# EAGLE design ABK-ECS - Rev A1 (EAGLE 7.7.0)

## Sheet 1 of 3: MCU
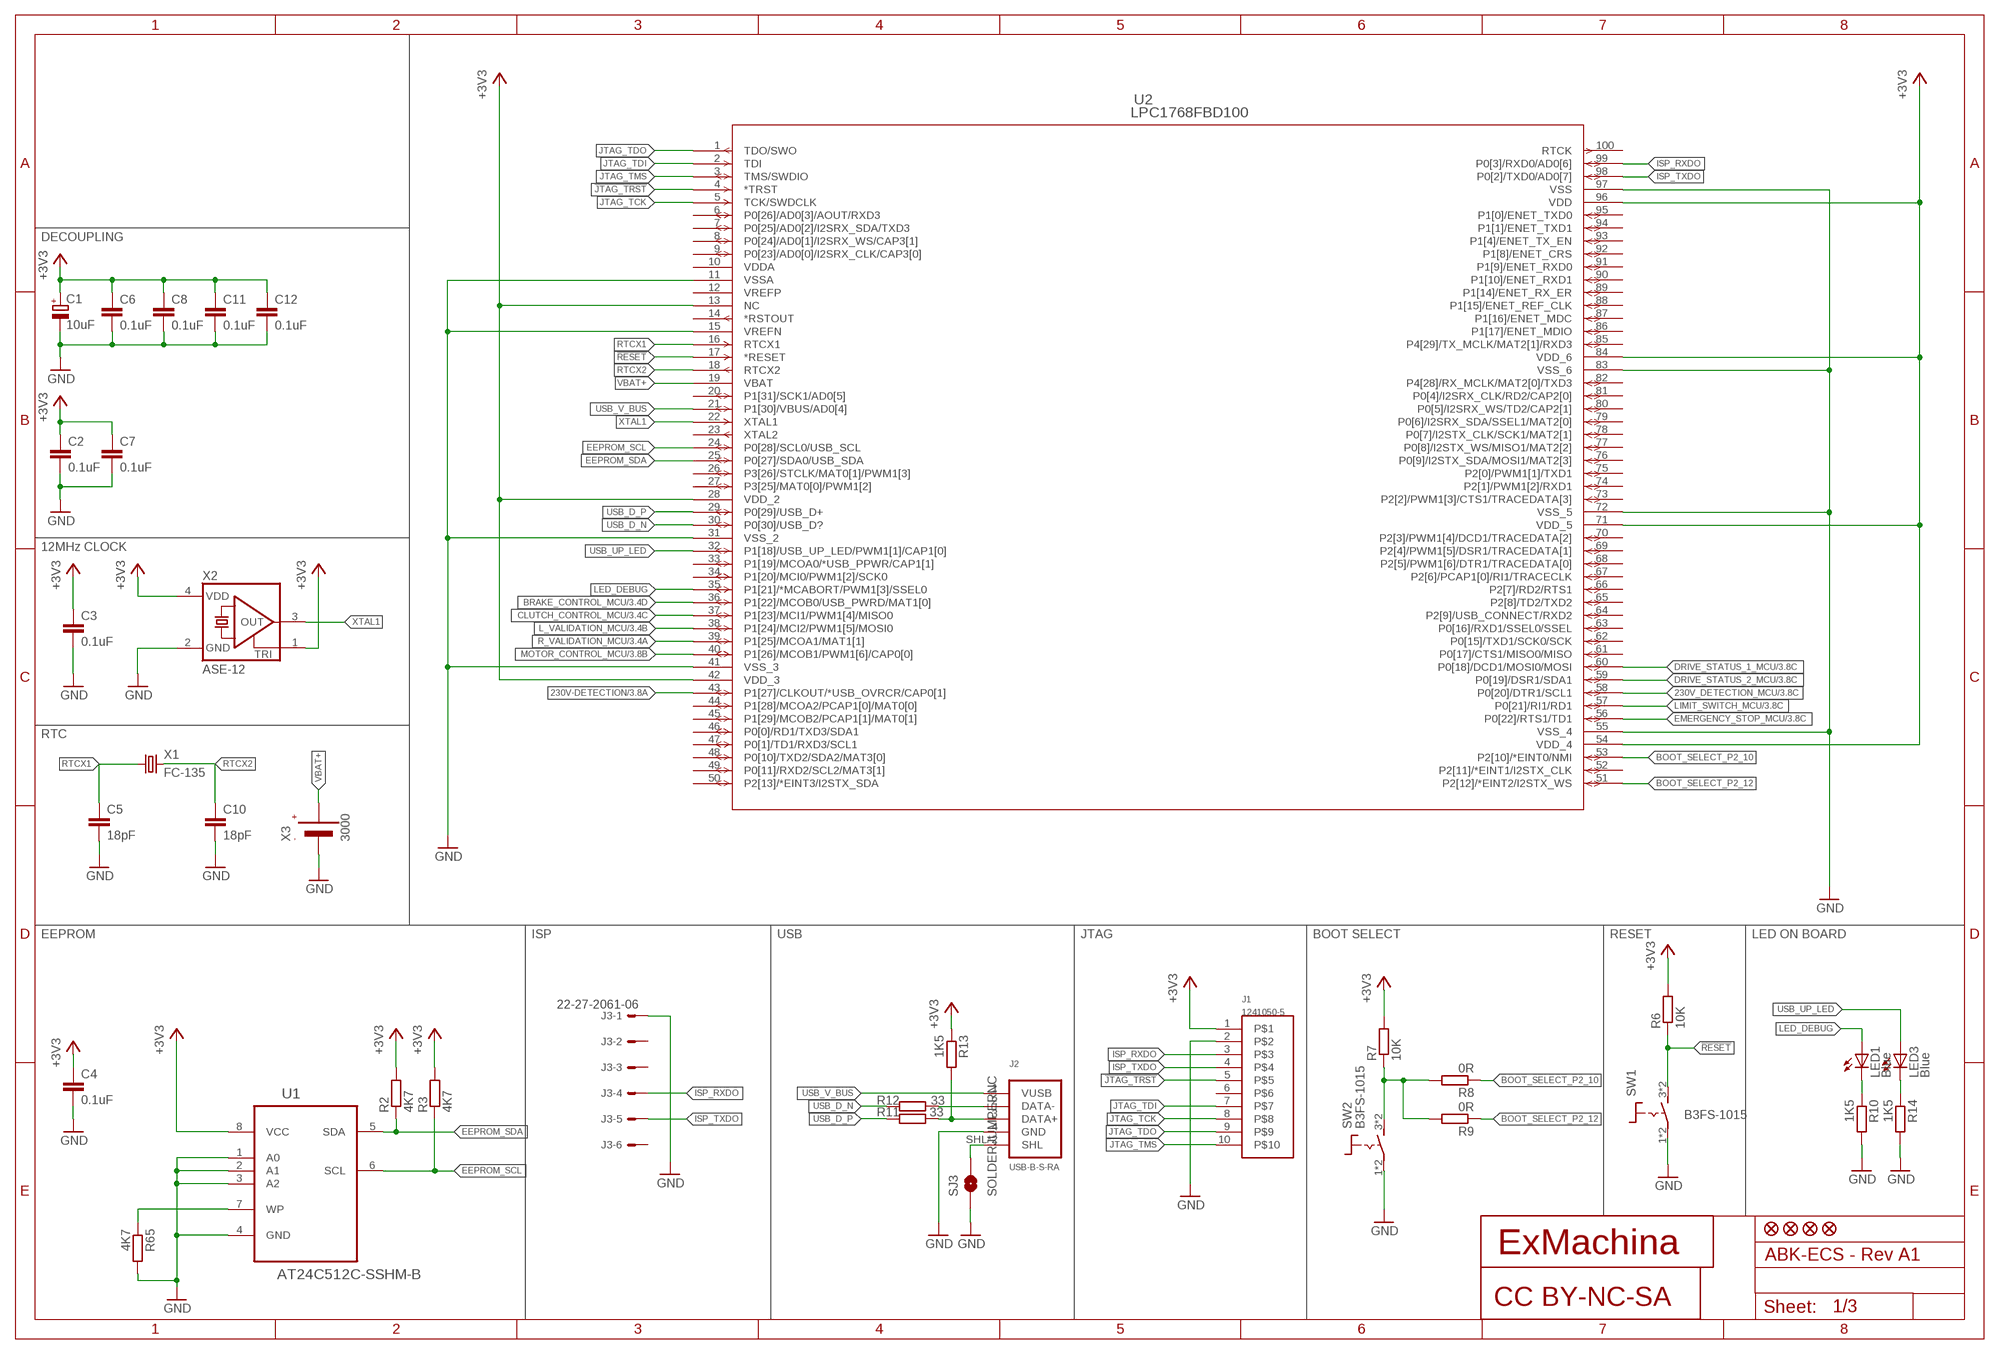
[diagram p0: schematic, sheet 1]

### Parts
C1  10uF  CPOL-EUCT3216  [CT3216]
C2  0.1uF  C-EUC0603  [C0603]
C3  0.1uF  C-EUC0603  [C0603]
C4  0.1uF  C-EUC0603  [C0603]
C5  18pF  C-EUC0603  [C0603]
C6  0.1uF  C-EUC0603  [C0603]
C7  0.1uF  C-EUC0603  [C0603]
C8  0.1uF  C-EUC0603  [C0603]
C10  18pF  C-EUC0603  [C0603]
C11  0.1uF  C-EUC0603  [C0603]
C12  0.1uF  C-EUC0603  [C0603]
CC1  CC-BY-NC-SA  [CC-BY-NC-SA]
J1  1241050-5  [2.54/2X5]
J2  USB-B-S-RA  [USB-B-S-RA]
J3  22-27-2061-06  [6410-06]
JP1  FIDUCIAL1X2  [FIDUCIAL-1X2]
JP2  FIDUCIAL1X2  [FIDUCIAL-1X2]
JP3  FIDUCIAL1X2  [FIDUCIAL-1X2]
JP4  FIDUCIAL1X2  [FIDUCIAL-1X2]
LED1  Blue  LEDCHIPLED_0603  [CHIPLED_0603]
LED3  Blue  LEDCHIPLED_0603  [CHIPLED_0603]
R2  4K7  R-EU_R0603  [R0603]
R3  4K7  R-EU_R0603  [R0603]
R6  10K  R-EU_R0603  [R0603]
R7  10K  R-EU_R0603  [R0603]
R8  0R  R-EU_R0603  [R0603]
R9  0R  R-EU_R0603  [R0603]
R10  1K5  R-EU_R0603  [R0603]
R11  33  R-EU_R0603  [R0603]
R12  33  R-EU_R0603  [R0603]
R13  1K5  R-EU_R0603  [R0603]
R14  1K5  R-EU_R0603  [R0603]
R65  4K7  R-EU_R0603  [R0603]
SJ3  SOLDERJUMPERNC  [SJ_2S]
SW1  B3FS-1015  [B3FS]
SW2  B3FS-1015  [B3FS]
T1  EXMACHINA-LOGO-NAME  [EXM-LOGO-BASELINE]
U1  AT24C512C-SSHM-B  [SOIC127P600X175-8N]
U2  LPC1768FBD100  [SOT407-1]
X1  FC-135  [FC-135]
X2  ASE-12  ASE  [ASE]
X3  3000  [3000]

### Nets
230V-DETECTION: U2.43(P1[27]/CLKOUT/*USB_OVRCR/CAP0[1]) ; also sheet 3
230V_DETECTION_MCU: U2.58(P0[20]/DTR1/SCL1) ; also sheet 3
!JTAG_TRST: J1.5 U2.4(*TRST)
!RESET: R6.1 SW1.3 SW1.4 U2.17(*RESET)
+3V3 [supply]: C1.+ C2.1 C3.1 C4.1 C6.1 C7.1 C8.1 C11.1 C12.1 J1.1 R2.2 R3.2 R6.2 R7.2 R13.1 U1.8(VCC) U2.13(NC) U2.28(VDD_2) U2.42(VDD_3) U2.54(VDD_4) U2.71(VDD_5) U2.84(VDD_6) U2.96(VDD) X2.1(TRI) X2.4(VDD) ; also sheet 2,3
BOOT_SELECT_P2_10 [signal]: R8.1 U2.53(P2[10]/*EINT0/NMI)
BOOT_SELECT_P2_12 [signal]: R9.1 U2.51(P2[12]/*EINT2/I2STX_WS)
BRAKE_CONTROL_MCU: U2.36(P1[22]/MCOB0/USB_PWRD/MAT1[0]) ; also sheet 3
CLUTCH_CONTROL_MCU: U2.37(P1[23]/MCI1/PWM1[4]/MISO0) ; also sheet 3
DRIVE_STATUS_1_MCU: U2.60(P0[18]/DCD1/MOSI0/MOSI) ; also sheet 3
DRIVE_STATUS_2_MCU: U2.59(P0[19]/DSR1/SDA1) ; also sheet 3
EEPROM_SCL: R3.1 U1.6(SCL) U2.24(P0[28]/SCL0/USB_SCL)
EEPROM_SDA: R2.1 U1.5(SDA) U2.25(P0[27]/SDA0/USB_SDA)
EMERGENCY_STOP_MCU: U2.56(P0[22]/RTS1/TD1) ; also sheet 3
GND [supply]: C1.- C2.2 C3.2 C4.2 C5.2 C6.2 C7.2 C8.2 C10.2 C11.2 C12.2 J1.2 J2.4(GND) J3.1 R10.2 R14.2 R65.2 SJ3.1 SW1.1 SW1.2 SW2.1 SW2.2 U1.1(A0) U1.2(A1) U1.3(A2) U1.4(GND) U2.11(VSSA) U2.15(VREFN) U2.31(VSS_2) U2.41(VSS_3) U2.55(VSS_4) U2.72(VSS_5) U2.83(VSS_6) U2.97(VSS) X2.2(GND) X3.-(VBAT-) ; also sheet 2,3
ISP_RXDO [signal]: J1.3 J3.4 U2.99(P0[3]/RXD0/AD0[6])
ISP_TXDO [signal]: J1.4 J3.5 U2.98(P0[2]/TXD0/AD0[7])
JTAG_TCK [signal]: J1.8 U2.5(TCK/SWDCLK)
JTAG_TDI [signal]: J1.7 U2.2(TDI)
JTAG_TDO [signal]: J1.9 U2.1(TDO/SWO)
JTAG_TMS [signal]: J1.10 U2.3(TMS/SWDIO)
L_VALIDATION_MCU: U2.38(P1[24]/MCI2/PWM1[5]/MOSI0) ; also sheet 3
LED_DEBUG [signal]: LED1.A U2.35(P1[21]/*MCABORT/PWM1[3]/SSEL0)
LIMIT_SWITCH_MCU: U2.57(P0[21]/RI1/RD1) ; also sheet 3
MOTOR_CONTROL_MCU: U2.40(P1[26]/MCOB1/PWM1[6]/CAP0[0]) ; also sheet 3
N$1 [signal]: J2.3(DATA+) R11.1 R13.2
N$2 [signal]: J2.2(DATA-) R12.1
N$3 [signal]: LED3.C R14.1
N$5 [signal]: R7.1 R8.2 R9.2 SW2.3 SW2.4
N$27: R65.1 U1.7(WP)
N$29 [signal]: LED1.C R10.1
N$70: J2.SHL J2.SHL1(SHL) SJ3.2
R_VALIDATION_MCU: U2.39(P1[25]/MCOA1/MAT1[1]) ; also sheet 3
RTCX1: C5.1 U2.16(RTCX1) X1.1
RTCX2: C10.1 U2.18(RTCX2) X1.2
USB_D_N [signal]: R12.2 U2.30(P0[30]/USB_D?)
USB_D_P [signal]: R11.2 U2.29(P0[29]/USB_D+)
USB_UP_LED [signal]: LED3.A U2.32(P1[18]/USB_UP_LED/PWM1[1]/CAP1[0])
USB_V_BUS [signal]: J2.1(VUSB) U2.21(P1[30]/VBUS/AD0[4])
VBAT+: U2.19(VBAT) X3.+1(VBAT+) X3.+2(VBAT+)
XTAL1: U2.22(XTAL1) X2.3(OUT)
Unconnected: J1.6 J3.2 J3.3 J3.6 U2.6(P0[26]/AD0[3]/AOUT/RXD3) U2.7(P0[25]/AD0[2]/I2SRX_SDA/TXD3) U2.8(P0[24]/AD0[1]/I2SRX_WS/CAP3[1]) U2.9(P0[23]/AD0[0]/I2SRX_CLK/CAP3[0]) U2.14(*RSTOUT) U2.20(P1[31]/SCK1/AD0[5]) U2.23(XTAL2) U2.26(P3[26]/STCLK/MAT0[1]/PWM1[3]) U2.27(P3[25]/MAT0[0]/PWM1[2]) U2.33(P1[19]/MCOA0/*USB_PPWR/CAP1[1]) U2.34(P1[20]/MCI0/PWM1[2]/SCK0) U2.44(P1[28]/MCOA2/PCAP1[0]/MAT0[0]) U2.45(P1[29]/MCOB2/PCAP1[1]/MAT0[1]) U2.46(P0[0]/RD1/TXD3/SDA1) U2.47(P0[1]/TD1/RXD3/SCL1) U2.48(P0[10]/TXD2/SDA2/MAT3[0]) U2.49(P0[11]/RXD2/SCL2/MAT3[1]) U2.50(P2[13]/*EINT3/I2STX_SDA) U2.52(P2[11]/*EINT1/I2STX_CLK) U2.61(P0[17]/CTS1/MISO0/MISO) U2.62(P0[15]/TXD1/SCK0/SCK) U2.63(P0[16]/RXD1/SSEL0/SSEL) U2.64(P2[9]/USB_CONNECT/RXD2) U2.65(P2[8]/TD2/TXD2) U2.66(P2[7]/RD2/RTS1) U2.67(P2[6]/PCAP1[0]/RI1/TRACECLK) U2.68(P2[5]/PWM1[6]/DTR1/TRACEDATA[0]) U2.69(P2[4]/PWM1[5]/DSR1/TRACEDATA[1]) U2.70(P2[3]/PWM1[4]/DCD1/TRACEDATA[2]) U2.73(P2[2]/PWM1[3]/CTS1/TRACEDATA[3]) U2.74(P2[1]/PWM1[2]/RXD1) U2.75(P2[0]/PWM1[1]/TXD1) U2.76(P0[9]/I2STX_SDA/MOSI1/MAT2[3]) U2.77(P0[8]/I2STX_WS/MISO1/MAT2[2]) U2.78(P0[7]/I2STX_CLK/SCK1/MAT2[1]) U2.79(P0[6]/I2SRX_SDA/SSEL1/MAT2[0]) U2.80(P0[5]/I2SRX_WS/TD2/CAP2[1]) U2.81(P0[4]/I2SRX_CLK/RD2/CAP2[0]) U2.82(P4[28]/RX_MCLK/MAT2[0]/TXD3) U2.85(P4[29]/TX_MCLK/MAT2[1]/RXD3) U2.86(P1[17]/ENET_MDIO) U2.87(P1[16]/ENET_MDC) U2.88(P1[15]/ENET_REF_CLK) U2.89(P1[14]/ENET_RX_ER) U2.90(P1[10]/ENET_RXD1) U2.91(P1[9]/ENET_RXD0) U2.92(P1[8]/ENET_CRS) U2.93(P1[4]/ENET_TX_EN) U2.94(P1[1]/ENET_TXD1) U2.95(P1[0]/ENET_TXD0) U2.100(RTCK)

### Notes on the sheet
- DECOUPLING
- 12MHz CLOCK
- RTC
- EEPROM | ISP | USB | JTAG | BOOT SELECT | RESET | LED ON BOARD

## Sheet 2 of 3: POWER
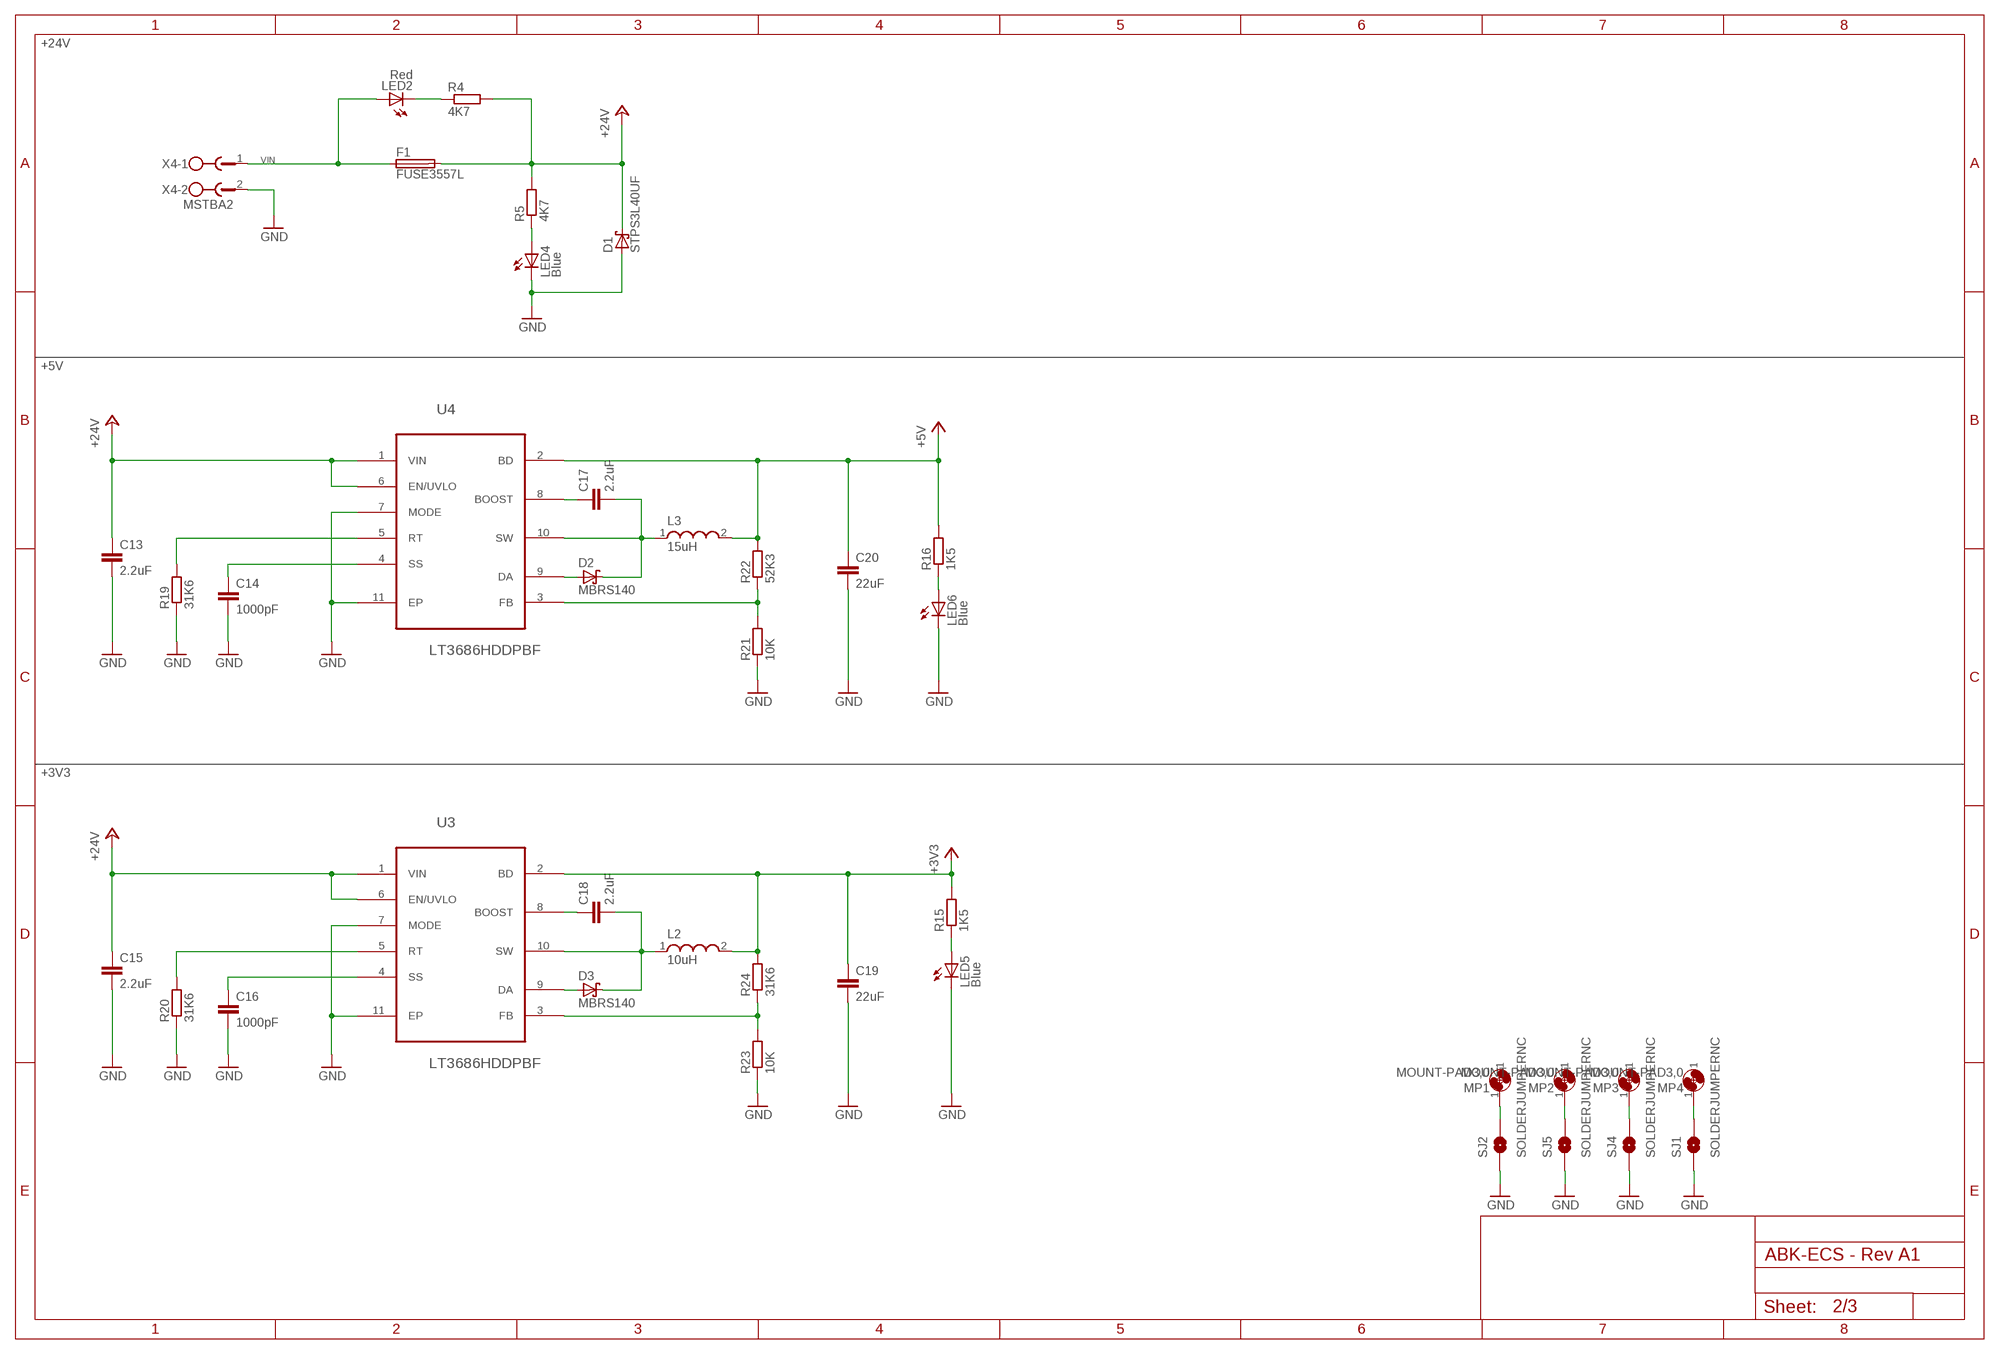
[diagram p1: schematic, sheet 2]

### Parts
C13  2.2uF  C-EUC0603  [C0603]
C14  1000pF  C-EUC0603  [C0603]
C15  2.2uF  C-EUC0603  [C0603]
C16  1000pF  C-EUC0603  [C0603]
C17  2.2uF  C-EUC0603  [C0603]
C18  2.2uF  C-EUC0603  [C0603]
C19  22uF  C-EUC0805  [C0805]
C20  22uF  C-EUC0805  [C0805]
D1  STPS3L40UF  [SMB]
D2  MBRS140  [DO-214AA]
D3  MBRS140  [DO-214AA]
F1  FUSE3557L  [3557-LITTLE]
L2  10uH  WE-PD2_5848/5820  [WE-PD2_5848/5820]
L3  15uH  WE-PD2_5848/5820  [WE-PD2_5848/5820]
LED2  Red  LEDCHIPLED_0603  [CHIPLED_0603]
LED4  Blue  LEDCHIPLED_0603  [CHIPLED_0603]
LED5  Blue  LEDCHIP-LED0603  [CHIP-LED0603]
LED6  Blue  LEDCHIP-LED0603  [CHIP-LED0603]
MP1  MOUNT-PAD3,0  [P3,0]
MP2  MOUNT-PAD3,0  [P3,0]
MP3  MOUNT-PAD3,0  [P3,0]
MP4  MOUNT-PAD3,0  [P3,0]
R4  4K7  R-EU_R0603  [R0603]
R5  4K7  R-EU_R0603  [R0603]
R15  1K5  R-EU_R0603  [R0603]
R16  1K5  R-EU_R0603  [R0603]
R19  31K6  R-EU_R0603  [R0603]
R20  31K6  R-EU_R0603  [R0603]
R21  10K  R-EU_R0603  [R0603]
R22  52K3  R-EU_R0603  [R0603]
R23  10K  R-EU_R0603  [R0603]
R24  31K6  R-EU_R0603  [R0603]
SJ1  SOLDERJUMPERNC  [SJ_2S]
SJ2  SOLDERJUMPERNC  [SJ_2S]
SJ4  SOLDERJUMPERNC  [SJ_2S]
SJ5  SOLDERJUMPERNC  [SJ_2S]
U3  LT3686HDDPBF  [DFN300X300X80-11N]
U4  LT3686HDDPBF  [DFN300X300X80-11N]
X4  MSTBA2  [MSTBA2]

### Nets
1: MP1.1 SJ2.2
2: MP2.1 SJ5.2
3: MP3.1 SJ4.2
4: MP4.1 SJ1.2
+3V3 [supply]: C19.1 L2.2 R15.2 R24.2 U3.2(BD) ; also sheet 1,3
+5V [supply]: C20.1 L3.2 R16.2 R22.2 U4.2(BD) ; also sheet 3
+24V: C13.1 C15.1 D1.C F1.3 F1.4 R4.2 R5.2 U3.1(VIN) U3.6(EN/UVLO) U4.1(VIN) U4.6(EN/UVLO) ; also sheet 3
GND [supply]: C13.2 C14.2 C15.2 C16.2 C19.2 C20.2 D1.A LED4.C LED5.C LED6.C R19.1 R20.1 R21.1 R23.1 SJ1.1 SJ2.1 SJ4.1 SJ5.1 U3.7(MODE) U3.11(EP) U4.7(MODE) U4.11(EP) X4.2 ; also sheet 1,3
N$4: R19.2 U4.5(RT)
N$6: C14.1 U4.4(SS)
N$7: R20.2 U3.5(RT)
N$8: C16.1 U3.4(SS)
N$9: R21.2 R22.1 U4.3(FB)
N$10: C17.1 U4.8(BOOST)
N$11: C17.2 D2.C L3.1 U4.10(SW)
N$12: D2.A U4.9(DA)
N$13: R23.2 R24.1 U3.3(FB)
N$14: C18.1 U3.8(BOOST)
N$15: C18.2 D3.C L2.1 U3.10(SW)
N$16: D3.A U3.9(DA)
N$44: LED4.A R5.1
N$45: LED2.C R4.1
N$50: LED5.A R15.1
N$51: LED6.A R16.1
VIN: F1.1 F1.2 LED2.A X4.1

### Notes on the sheet
- +24V
- +5V
- +3V3

## Sheet 3 of 3
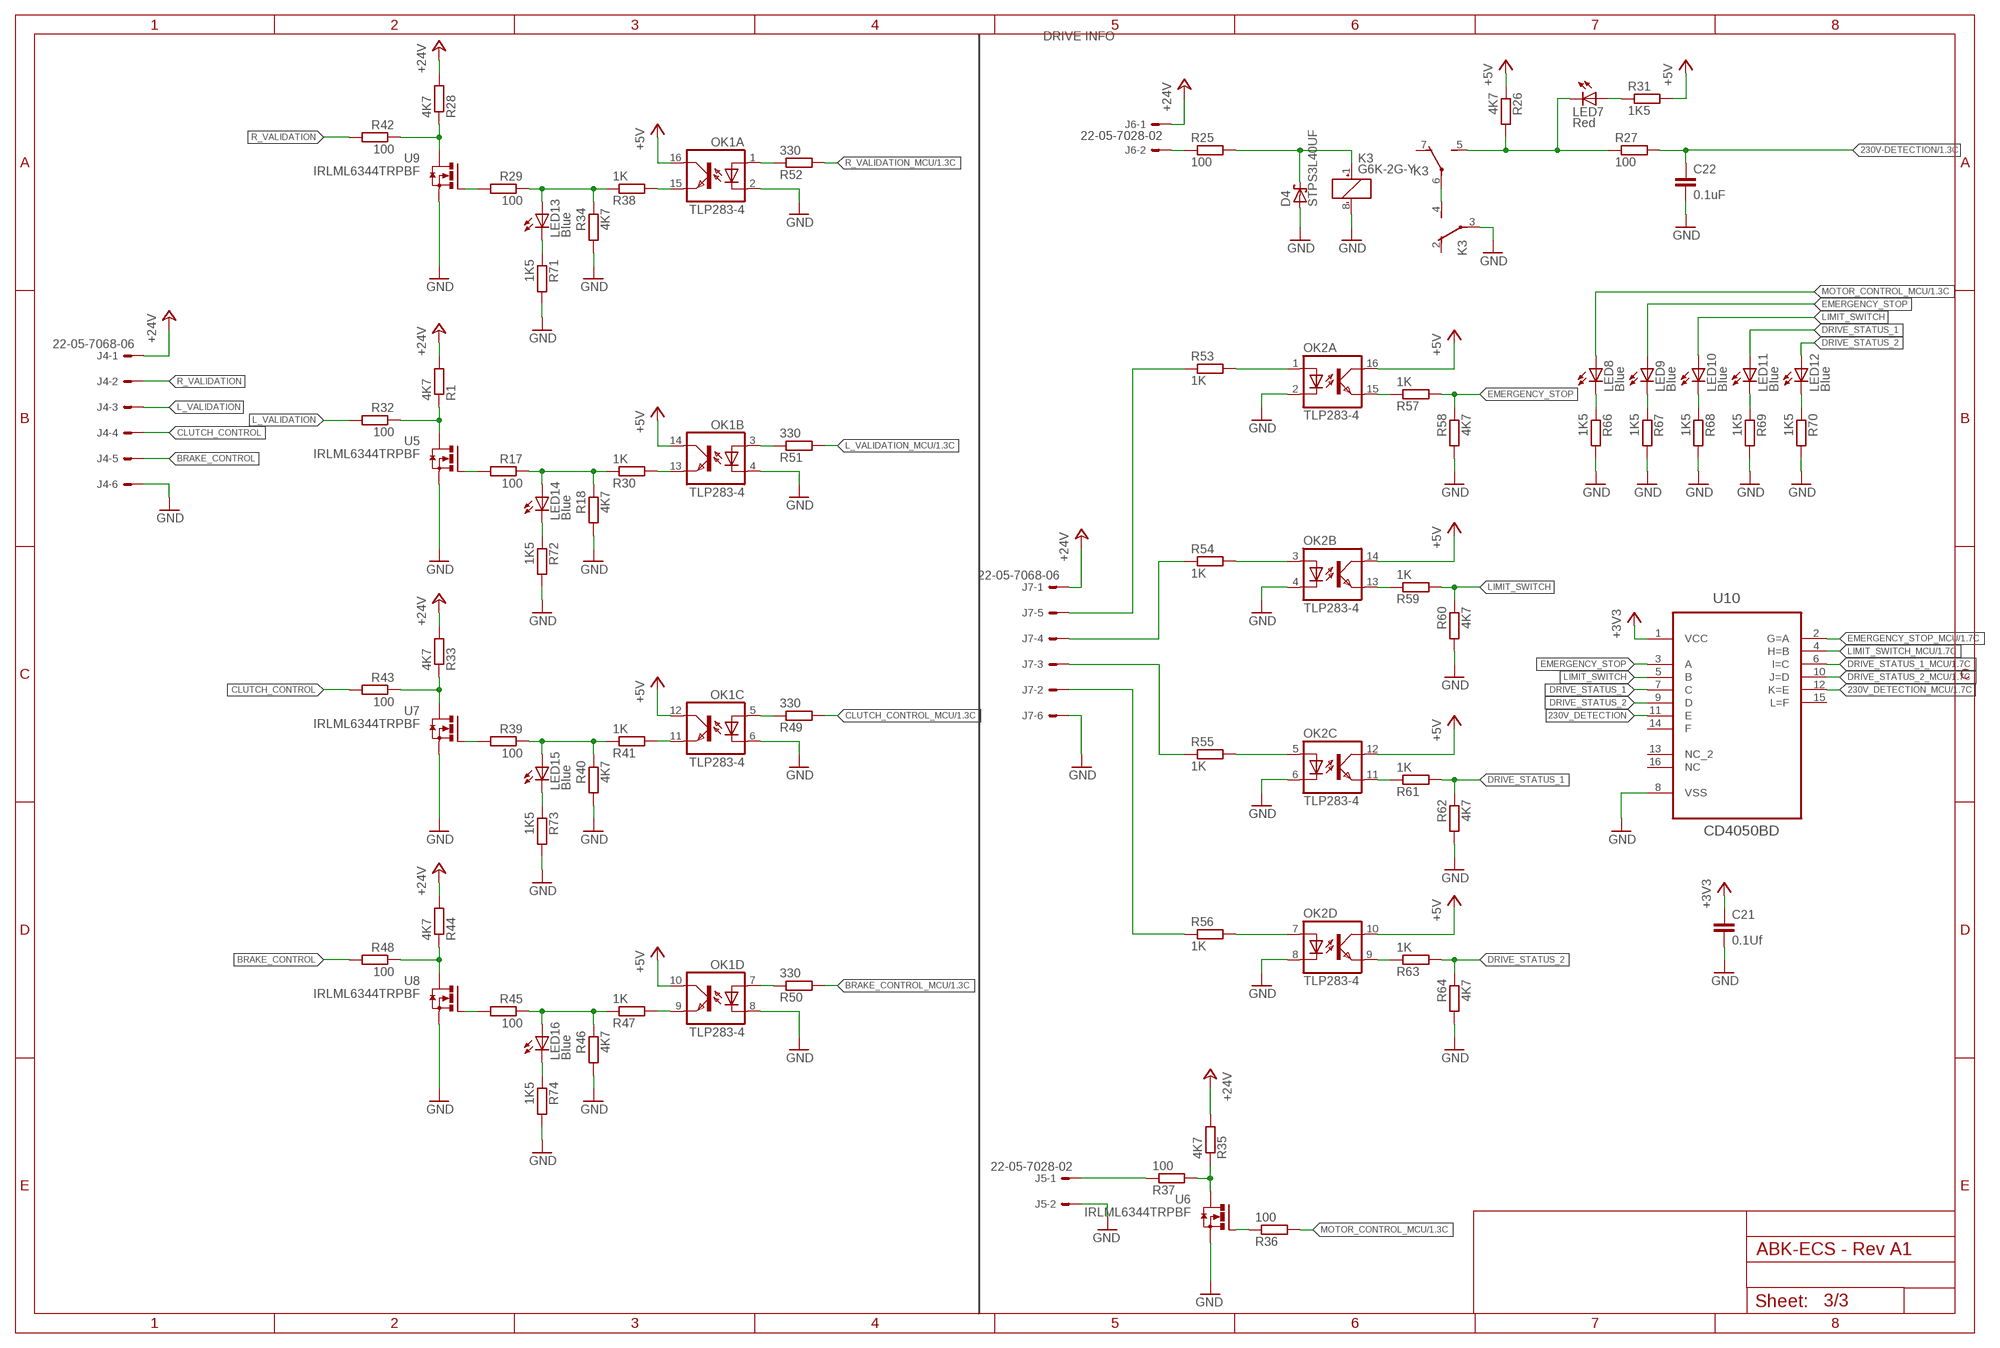
[diagram p2: schematic, sheet 3]

### Parts
C21  0.1Uf  C-EUC0603  [C0603]
C22  0.1uF  C-EUC0603  [C0603]
D4  STPS3L40UF  [SMB]
J4  22-05-7068-06  [7395-06]
J5  22-05-7028-02  [7395-02]
J6  22-05-7028-02  [7395-02]
J7  22-05-7068-06  [7395-06]
K3  G6K-2G-Y  [G6K-2G-Y]
LED7  Red  LEDCHIPLED_0603  [CHIPLED_0603]
LED8  Blue  LEDCHIPLED_0603  [CHIPLED_0603]
LED9  Blue  LEDCHIPLED_0603  [CHIPLED_0603]
LED10  Blue  LEDCHIPLED_0603  [CHIPLED_0603]
LED11  Blue  LEDCHIPLED_0603  [CHIPLED_0603]
LED12  Blue  LEDCHIPLED_0603  [CHIPLED_0603]
LED13  Blue  LEDCHIPLED_0603  [CHIPLED_0603]
LED14  Blue  LEDCHIPLED_0603  [CHIPLED_0603]
LED15  Blue  LEDCHIPLED_0603  [CHIPLED_0603]
LED16  Blue  LEDCHIPLED_0603  [CHIPLED_0603]
OK1  TLP283-4  [MINI-FLAT-16]
OK2  TLP283-4  [MINI-FLAT-16]
R1  4K7  R-EU_R0603  [R0603]
R17  100  R-EU_R0603  [R0603]
R18  4K7  R-EU_R0603  [R0603]
R25  100  R-EU_R0603  [R0603]
R26  4K7  R-EU_R0603  [R0603]
R27  100  R-EU_R0603  [R0603]
R28  4K7  R-EU_R0603  [R0603]
R29  100  R-EU_R0603  [R0603]
R30  1K  R-EU_R0603  [R0603]
R31  1K5  R-EU_R0603  [R0603]
R32  100  R-EU_R0603  [R0603]
R33  4K7  R-EU_R0603  [R0603]
R34  4K7  R-EU_R0603  [R0603]
R35  4K7  R-EU_R0603  [R0603]
R36  100  R-EU_R0603  [R0603]
R37  100  R-EU_R0603  [R0603]
R38  1K  R-EU_R0603  [R0603]
R39  100  R-EU_R0603  [R0603]
R40  4K7  R-EU_R0603  [R0603]
R41  1K  R-EU_R0603  [R0603]
R42  100  R-EU_R0603  [R0603]
R43  100  R-EU_R0603  [R0603]
R44  4K7  R-EU_R0603  [R0603]
R45  100  R-EU_R0603  [R0603]
R46  4K7  R-EU_R0603  [R0603]
R47  1K  R-EU_R0603  [R0603]
R48  100  R-EU_R0603  [R0603]
R49  330  R-EU_R0603  [R0603]
R50  330  R-EU_R0603  [R0603]
R51  330  R-EU_R0603  [R0603]
R52  330  R-EU_R0603  [R0603]
R53  1K  R-EU_R0603  [R0603]
R54  1K  R-EU_R0603  [R0603]
R55  1K  R-EU_R0603  [R0603]
R56  1K  R-EU_R0603  [R0603]
R57  1K  R-EU_R0603  [R0603]
R58  4K7  R-EU_R0603  [R0603]
R59  1K  R-EU_R0603  [R0603]
R60  4K7  R-EU_R0603  [R0603]
R61  1K  R-EU_R0603  [R0603]
R62  4K7  R-EU_R0603  [R0603]
R63  1K  R-EU_R0603  [R0603]
R64  4K7  R-EU_R0603  [R0603]
R66  1K5  R-EU_R0603  [R0603]
R67  1K5  R-EU_R0603  [R0603]
R68  1K5  R-EU_R0603  [R0603]
R69  1K5  R-EU_R0603  [R0603]
R70  1K5  R-EU_R0603  [R0603]
R71  1K5  R-EU_R0603  [R0603]
R72  1K5  R-EU_R0603  [R0603]
R73  1K5  R-EU_R0603  [R0603]
R74  1K5  R-EU_R0603  [R0603]
U5  IRLML6344TRPBF  [SOT95P240X112-3N]
U6  IRLML6344TRPBF  [SOT95P240X112-3N]
U7  IRLML6344TRPBF  [SOT95P240X112-3N]
U8  IRLML6344TRPBF  [SOT95P240X112-3N]
U9  IRLML6344TRPBF  [SOT95P240X112-3N]
U10  CD4050BD  [SOIC127P600X175-16N]

### Nets
230V-DETECTION: C22.1 R27.2 ; also sheet 1
230V_DETECTION: U10.11(E)
230V_DETECTION_MCU: U10.12(K=E) ; also sheet 1
+3V3 [supply]: C21.1 U10.1(VCC) ; also sheet 1,2
+5V [supply]: OK1.10(D:COL) OK1.12(C:COL) OK1.14(B:COL) OK1.16(A:COL) OK2.10(D:COL) OK2.12(C:COL) OK2.14(B:COL) OK2.16(A:COL) R26.1 R31.2 ; also sheet 2
+24V: J4.1 J6.1 J7.1 R1.2 R28.2 R33.2 R35.2 R44.2 ; also sheet 2
BRAKE_CONTROL: J4.5 R48.2
BRAKE_CONTROL_MCU: R50.2 ; also sheet 1
CLUTCH_CONTROL: J4.4 R43.2
CLUTCH_CONTROL_MCU: R49.2 ; also sheet 1
DRIVE_STATUS_1: LED11.A R61.2 R62.1 U10.7(C)
DRIVE_STATUS_1_MCU: U10.6(I=C) ; also sheet 1
DRIVE_STATUS_2: LED12.A R63.2 R64.1 U10.9(D)
DRIVE_STATUS_2_MCU: U10.10(J=D) ; also sheet 1
EMERGENCY_STOP: LED9.A R57.2 R58.1 U10.3(A)
EMERGENCY_STOP_MCU: U10.2(G=A) ; also sheet 1
GND [supply]: C21.2 C22.2 D4.A J4.6 J5.2 J7.6 K3.3(2:P) K3.8(1:-) OK1.2(A:C) OK1.4(B:C) OK1.6(C:C) OK1.8(D:C) OK2.2(A:C) OK2.4(B:C) OK2.6(C:C) OK2.8(D:C) R18.2 R34.2 R40.2 R46.2 R58.2 R60.2 R62.2 R64.2 R66.2 R67.2 R68.2 R69.2 R70.2 R71.2 R72.2 R73.2 R74.2 U5.2(S) U6.2(S) U7.2(S) U8.2(S) U9.2(S) U10.8(VSS) ; also sheet 1,2
L_VALIDATION: J4.3 R32.2
L_VALIDATION_MCU: R51.2 ; also sheet 1
LIMIT_SWITCH: LED10.A R59.2 R60.1 U10.5(B)
LIMIT_SWITCH_MCU: U10.4(H=B) ; also sheet 1
MOTOR_CONTROL_MCU: LED8.A R36.2 ; also sheet 1
N$17: R1.1 R32.1 U5.3(D)
N$18: R28.1 R42.1 U9.3(D)
N$19: R29.2 U9.1(G)
N$20: LED13.A R29.1 R34.1 R38.1
N$21: OK1.15(A:EMIT) R38.2
N$22: R17.2 U5.1(G)
N$23: R36.1 U6.1(G)
N$24: R35.1 R37.2 U6.3(D)
N$25: LED14.A R17.1 R18.1 R30.1
N$26: J5.1 R37.1
N$28: D4.C K3.1(1:+) R25.2
N$30: OK1.13(B:EMIT) R30.2
N$31: R33.1 R43.1 U7.3(D)
N$32: J6.2 R25.1
N$33: R39.2 U7.1(G)
N$34: LED15.A R39.1 R40.1 R41.1
N$35: R44.1 R48.1 U8.3(D)
N$36: R45.2 U8.1(G)
N$37: LED16.A R45.1 R46.1 R47.1
N$38: OK1.11(C:EMIT) R41.2
N$39: OK1.9(D:EMIT) R47.2
N$40: OK1.1(A:A) R52.1
N$41: OK2.1(A:A) R53.2
N$42: OK1.3(B:A) R51.1
N$43: OK1.7(D:A) R50.1
N$46: OK1.5(C:A) R49.1
N$47: OK2.3(B:A) R54.2
N$48: OK2.5(C:A) R55.2
N$49: OK2.7(D:A) R56.2
N$52: J7.2 R56.1
N$53: J7.3 R55.1
N$54: J7.4 R54.1
N$55: J7.5 R53.1
N$56 [signal]: LED8.C R66.1
N$57 [signal]: LED9.C R67.1
N$58 [signal]: LED10.C R68.1
N$59 [signal]: LED11.C R69.1
N$60: K3.4(2:S) K3.6(3:P)
N$61: OK2.9(D:EMIT) R63.1
N$62: OK2.11(C:EMIT) R61.1
N$63: OK2.13(B:EMIT) R59.1
N$64: OK2.15(A:EMIT) R57.1
N$65 [signal]: LED12.C R70.1
N$66 [signal]: LED13.C R71.1
N$67 [signal]: LED14.C R72.1
N$68 [signal]: LED15.C R73.1
N$69 [signal]: LED16.C R74.1
N$73: K3.5(3:S) LED7.C R26.2 R27.1
N$74: LED7.A R31.1
R_VALIDATION: J4.2 R42.2
R_VALIDATION_MCU: R52.2 ; also sheet 1
Unconnected: K3.2(2:O) K3.7(3:O) U10.13(NC_2) U10.14(F) U10.15(L=F) U10.16(NC)

### Notes on the sheet
- DRIVE INFO

## Power pins joined to a net without a drawn wire
VDDA: U2.10(VDDA)
VREFP: U2.12(VREFP)

## Library data of the parts
C1 = rcl:CPOL-EU: POLARIZED CAPACITOR, European symbol; MPN: F931A106MAA; OC_NEWARK: 58R3260
C2-C4 C6-C8 C11 C12 C22 = rcl:C-EU: CAPACITOR, European symbol; MPN: MC0603B104K160CT; OC_NEWARK: 06R4923
C5 C10 = rcl:C-EU: CAPACITOR, European symbol; MPN: MC0603N180K500CT; OC_NEWARK: 06R5140
C13 C15 C17 C18 = rcl:C-EU: CAPACITOR, European symbol; MPN: GRT188R61H225KE13D; OC_NEWARK: 01AC8938
C14 C16 = rcl:C-EU: CAPACITOR, European symbol; MPN: MC0603B102K500CT; OC_NEWARK: 06R4910
C19 C20 = rcl:C-EU: CAPACITOR, European symbol; MPN: MCMT21N220F250CT; OC_NEWARK: 23T7233
C21 = rcl:C-EU: CAPACITOR, European symbol; MPN: MC0603B104K500CT; OC_NEWARK: 06R4927
CC1 = cc-by-sa:CC-BY-NC-SA; OC_NEWARK: unknown
D1 D4 = diode:STPS3L40?; MP: STMICROELECTRONICS; MPN: STPS3L40UF; OC_FARNELL: 2341599; OC_NEWARK: 06X0873
D2 D3 = diode:MBRS140: Redresseur Schottky, 40 V, 1 A, Une, DO-214AA, 2 Broche(s), 600 mV; MF: ON SEMICONDUCTOR; MPN: MBRS140T3G; OC_NEWARK: 83H7272
F1 = fuse2:FUSE: Fuse; MPN: 3557; OC_NEWARK: 22M2711
J1 = con-amp:1241050-5; MPN: 1241050-5; OC_NEWARK: 98K5467
J2 = con-multicomp:USB-B-S-RA: MULTICOMP USB-B-S-RA USB Connector, USB Type B, USB 2.0, Receptacle, 4 Positions, Through Hole Mount, Right Angle; MPN: USB-B-S-RA; OC_NEWARK: 14N8154
J3 = con-molex:22-?-06: CONNECTOR wire to board 2.54 mm (.1 inch) pitch header; MF: MOLEX; MPN: 22-27-2061; OC_FARNELL: unknown; OC_NEWARK: 56H0719
J4 J7 = con-molex:22-?-06: CONNECTOR wire to board 2.54 mm (.1 inch) pitch header; MPN: 22-05-7068; OC_FARNELL: unknown; OC_NEWARK: 25M1733
J5 J6 = con-molex:22-?-02: CONNECTOR wire to board 2.54 mm (.1 inch) pitch header; MPN: 22-05-7028; OC_FARNELL: 9731601; OC_NEWARK: 25M1728
JP1-JP4 = SparkFun:FIDUCIAL: Fiducial Alignment Points Various fiducial points for machine vision alignment.; OC_NEWARK: unknown
K3 = relay:G6K: Low Signal Relay oeiwcsnts1.omron.com/.. D20G6K0100.pdf; MPN: G6K-2G-Y 24DC; OC_FARNELL: 4484794; OC_NEWARK: 82T9378
L2 = Wurth-POWER_MAGNETICS-rev16f:WE-PD2: SMD Power Inductor Characteristics Open size Saturation currents up to 14 A Low tolerances at high inductance values Operating temperature: –40 °C to +125 °C Applications Integrated DC/DC-converter Switching regulators with low operating voltages (Graphic cards, embedded PC-Cards, Mainboards) Optimal attenuation in MHz frequency range Details see: http://katalog.we-online.de/en/pbs/WE-PD2 Updated by Dan Xu 2014-07-08 2014 (C) Wurth Elektronik; MPN: 74477410; OC_NEWARK: 08P2817
L3 = Wurth-POWER_MAGNETICS-rev16f:WE-PD2: SMD Power Inductor Characteristics Open size Saturation currents up to 14 A Low tolerances at high inductance values Operating temperature: –40 °C to +125 °C Applications Integrated DC/DC-converter Switching regulators with low operating voltages (Graphic cards, embedded PC-Cards, Mainboards) Optimal attenuation in MHz frequency range Details see: http://katalog.we-online.de/en/pbs/WE-PD2 Updated by Dan Xu 2014-07-08 2014 (C) Wurth Elektronik; MPN: 744774115; OC_NEWARK: 08P2818
LED1-LED4 LED7-LED16 = led:LED: LED OSRAM: - CHIPLED LG R971, LG N971, LY N971, LG Q971, LY Q971, LO R971, LY R971 LH N974, LH R974 LS Q976, LO Q976, LY Q976 LO Q996 - Hyper CHIPLED LW Q18S LB Q993, LB Q99A, LB R99A - SideLED LS A670, LO A670, LY A670, LG A670, LP A670 LB A673, LV A673, LT A673, LW A673 LH A674 LY A675 LS A676, LA A676, LO A676, LY A676, LW A676 LS A679, LY A679, LG A679 - Hyper Micro SIDELED® LS Y876, LA Y876, LO Y876, LY Y876 LT Y87S - SmartLED LW L88C, LW L88S LB L89C, LB L89S, LG L890 LS L89K, LO L89K, LY L89K LS L896, LA L896, LO L896, LY L896 - TOPLED LS T670, LO T670, LY T670, LG T670, LP T670 LSG T670, LSP T670, LSY T670, LOP T670, LYG T670 LG T671, LOG T671, LSG T671 LB T673, LV T673, LT T673, LW T673 LH T674 LS T676, LA T676, LO T676, LY T676, LB T676, LH T676, LSB T676, LW T676 LB T67C, LV T67C, LT T67C, LS T67K, LO T67K, LY T67K, LW E67C LS E67B, LA E67B, LO E67B, LY E67B, LB E67C, LV E67C, LT E67C LW T67C LS T679, LY T679, LG T679 LS T770, LO T770, LY T770, LG T770, LP T770 LB T773, LV T773, LT T773, LW T773 LH T774 LS E675, LA E675, LY E675, LS T675 LS T776, LA T776, LO T776, LY T776, LB T776 LHGB T686 LT T68C, LB T68C - Hyper Mini TOPLED® LB M676 - Mini TOPLED Santana® LG M470 LS M47K, LO M47K, LY M47K Source: http://www.osram.convergy.de LUXEON: - LUMILED® LXK2-PW12-R00, LXK2-PW12-S00, LXK2-PW14-U00, LXK2-PW14-V00 LXK2-PM12-R00, LXK2-PM12-S00, LXK2-PM14-U00 LXK2-PE12-Q00, LXK2-PE12-R00, LXK2-PE12-S00, LXK2-PE14-T00, LXK2-PE14-U00 LXK2-PB12-K00, LXK2-PB12-L00, LXK2-PB12-M00, LXK2-PB14-N00, LXK2-PB14-P00, LXK2-PB14-Q00 LXK2-PR12-L00, LXK2-PR12-M00, LXK2-PR14-Q00, LXK2-PR14-R00 LXK2-PD12-Q00, LXK2-PD12-R00, LXK2-PD12-S00 LXK2-PH12-R00, LXK2-PH12-S00 LXK2-PL12-P00, LXK2-PL12-Q00, LXK2-PL12-R00 Source: www.luxeon.com KINGBRIGHT: KA-3528ASYC Source: www.kingbright.com; MPN: OVS-0603; OC_NEWARK: 15R2205
LED5 LED6 = led:LED: LED OSRAM: - CHIPLED LG R971, LG N971, LY N971, LG Q971, LY Q971, LO R971, LY R971 LH N974, LH R974 LS Q976, LO Q976, LY Q976 LO Q996 - Hyper CHIPLED LW Q18S LB Q993, LB Q99A, LB R99A - SideLED LS A670, LO A670, LY A670, LG A670, LP A670 LB A673, LV A673, LT A673, LW A673 LH A674 LY A675 LS A676, LA A676, LO A676, LY A676, LW A676 LS A679, LY A679, LG A679 - Hyper Micro SIDELED® LS Y876, LA Y876, LO Y876, LY Y876 LT Y87S - SmartLED LW L88C, LW L88S LB L89C, LB L89S, LG L890 LS L89K, LO L89K, LY L89K LS L896, LA L896, LO L896, LY L896 - TOPLED LS T670, LO T670, LY T670, LG T670, LP T670 LSG T670, LSP T670, LSY T670, LOP T670, LYG T670 LG T671, LOG T671, LSG T671 LB T673, LV T673, LT T673, LW T673 LH T674 LS T676, LA T676, LO T676, LY T676, LB T676, LH T676, LSB T676, LW T676 LB T67C, LV T67C, LT T67C, LS T67K, LO T67K, LY T67K, LW E67C LS E67B, LA E67B, LO E67B, LY E67B, LB E67C, LV E67C, LT E67C LW T67C LS T679, LY T679, LG T679 LS T770, LO T770, LY T770, LG T770, LP T770 LB T773, LV T773, LT T773, LW T773 LH T774 LS E675, LA E675, LY E675, LS T675 LS T776, LA T776, LO T776, LY T776, LB T776 LHGB T686 LT T68C, LB T68C - Hyper Mini TOPLED® LB M676 - Mini TOPLED Santana® LG M470 LS M47K, LO M47K, LY M47K Source: http://www.osram.convergy.de LUXEON: - LUMILED® LXK2-PW12-R00, LXK2-PW12-S00, LXK2-PW14-U00, LXK2-PW14-V00 LXK2-PM12-R00, LXK2-PM12-S00, LXK2-PM14-U00 LXK2-PE12-Q00, LXK2-PE12-R00, LXK2-PE12-S00, LXK2-PE14-T00, LXK2-PE14-U00 LXK2-PB12-K00, LXK2-PB12-L00, LXK2-PB12-M00, LXK2-PB14-N00, LXK2-PB14-P00, LXK2-PB14-Q00 LXK2-PR12-L00, LXK2-PR12-M00, LXK2-PR14-Q00, LXK2-PR14-R00 LXK2-PD12-Q00, LXK2-PD12-R00, LXK2-PD12-S00 LXK2-PH12-R00, LXK2-PH12-S00 LXK2-PL12-P00, LXK2-PL12-Q00, LXK2-PL12-R00 Source: www.luxeon.com KINGBRIGHT: KA-3528ASYC Source: www.kingbright.com; MPN: OVS-0603; OC_FARNELL: 1716771; OC_NEWARK: 15R2205
MP1-MP4 = holes:MOUNT-PAD: MOUNTING HOLE with drill center marker; OC_NEWARK: unknown
OK1 OK2 = optocoupler:TLP283-4: TOSHIBA PHOTOCOUPLER GaAs IRED & PHOTO-TRANSISTOR Source: http://www.semicon.toshiba.co.jp/td/en/Opto/Photocoupler/en_20050928_TLP283_datasheet.pdf; MF: VISHAY/TELEFUNKEN; MPN: TCMT4100; OC_FARNELL: unknown; OC_NEWARK: 06H1639
R1-R5 R18 R26 R28 R33-R35 R40 R44 R46 R58 R60 R62 R64 R65 = rcl:R-EU_: RESISTOR, European symbol; MPN: MCMR06X4701FTL; OC_NEWARK: 86T3649
R6 R7 = rcl:R-EU_: RESISTOR, European symbol; MPN: MCMR06X1002FTL; OC_NEWARK: 86T3506
R8 R9 = rcl:R-EU_: RESISTOR, European symbol; MPN: MCMR06X000 PTL; OC_NEWARK: 86T3500
R10 R13 R14 R31 R66-R74 = rcl:R-EU_: RESISTOR, European symbol; MPN: MCMR06X1501FTL; OC_NEWARK: 86T3542
R11 R12 = rcl:R-EU_: RESISTOR, European symbol; MPN: MCMR06X33R0FTL; OC_NEWARK: 86T3614
R15 R16 = rcl:R-EU_: RESISTOR, European symbol; MPN: MCMR06X1501FTL; OC_FARNELL: 2073391; OC_NEWARK: 86T3542
R17 R25 R27 R29 R32 R36 R37 R39 R42 R43 R45 R48 = rcl:R-EU_: RESISTOR, European symbol; MPN: MCMR06X1000FTL; OC_NEWARK: 86T3504
R19 R20 R24 = rcl:R-EU_: RESISTOR, European symbol; MPN: MCMR06X3162FTL; OC_FARNELL: 2073391; OC_NEWARK: 86T3613
R21 R23 = rcl:R-EU_: RESISTOR, European symbol; MPN: MCMR06X1002FTL; OC_FARNELL: 2073391; OC_NEWARK: 86T3506
R22 = rcl:R-EU_: RESISTOR, European symbol; MPN: MC0063W0603152K3; OC_FARNELL: 2073391; OC_NEWARK: 26M0962
R30 R38 R41 R47 R53-R57 R59 R61 R63 = rcl:R-EU_: RESISTOR, European symbol; MPN: MCMR06X1001FTL; OC_NEWARK: 86T3505
R49-R52 = rcl:R-EU_: RESISTOR, European symbol; MPN: MCMR06X3300FTL; OC_NEWARK: 86T3616
SJ1 SJ2 SJ4 SJ5 = SparkFun-Passives:SOLDERJUMPER: Solder Jumper Standard SMD solder jumper. Used to automate production. Two varients : Normally Open and Normally Closed are the same, but have different paste layers. NC will have a large amount of paste and should jumper during reflow.; OC_NEWARK: unknown
SJ3 = SparkFun-Passives:SOLDERJUMPER: Solder Jumper Standard SMD solder jumper. Used to automate production. Two varients : Normally Open and Normally Closed are the same, but have different paste layers. NC will have a large amount of paste and should jumper during reflow.
SW1 SW2 = Switch_SMT:B3FS: Surface-mounting Switches Ideal for High-density Mounting; MPN: B3FS-1010; OC_NEWARK: 36M3638
T1 = exmachina:EXMACHINA-LOGO; OC_NEWARK: unknown
U1 = atmel:AT24C512C-SSHM-B: SERIAL EEPROM IC Memory Size:512Kbit,8-SOIC; MPN: AT24C02C-SSHM-B; OC_FARNELL: 1971995; OC_NEWARK: 68T4066; PACKAGE: 8SOIC; SUPPLIER: ATMEL
U2 = NXP:LPC1768FBD100; COPYRIGHT: Copyright C 2015 Accelerated Designs. All rights reserved; MANUFACTURER_PART_NUMBER: lpc1768fbd100; MPN: LPC1768FBD100; OC_NEWARK: 15R1840; VENDOR: NXP
U3 U4 = lineartechnology:LT3686HDDPBF: 37V/1.2A Step-DownRegulator in 3mm × 3mm DFN; MPN: LT3686HDD#PBF; OC_FARNELL: 2294943; OC_NEWARK: 78R8986; PACKAGE: DFN-10; SUPPLIER: Linear Technology
U5-U9 = International_Rectifier_By_element14_Batch_1:IRLML6344TRPBF: Power MOSFET; MPN: IRLML6344TRPBF; OC_FARNELL: 1857299; OC_NEWARK: 25T5501; PACKAGE: SOT-23-3; SUPPLIER: INTERNATIONAL RECTIFIER
U10 = TI-CD4050BD:CD4050BD: CMOS Hex Buffer/Converters; MPN: CD4050BD; OC_FARNELL: 1740857; OC_NEWARK: 50R5062; PACKAGE: 16-SOIC; SUPPLIER: Texas Instruments
X1 = crystal:FC-135: 32.768kHz ±20ppm Crystal 12.5pF 70 kOhm -40°C ~ 85°C Surface Mount 2-SMD; MPN: Q13FC13500004; OC_NEWARK: 31M4970
X2 = crystal:ASE: 3.3Vdc CMOS SMD CRYSTAL CLOCK OSCILLATOR SOurce: www.abracon.com; MPN: ASE-12.000MHZ-LC-T; OC_FARNELL: unknown; OC_NEWARK: 40Y2118
X3 = keystone:3000; MF: KEYSTONE ELECTR; MPN: 3000; OC_NEWARK: 66F5622
X4 = con-phoenix-508:MSTBA2: PHOENIX; MF: FARNELL; MPN: 1757242; OC_FARNELL: 3705171; OC_NEWARK: 71C4161

## Net classes
1 signal: width 0.178 mm, drill 0.35 mm
2 supply: width 0.008 mm, drill 0.5 mm

## Board
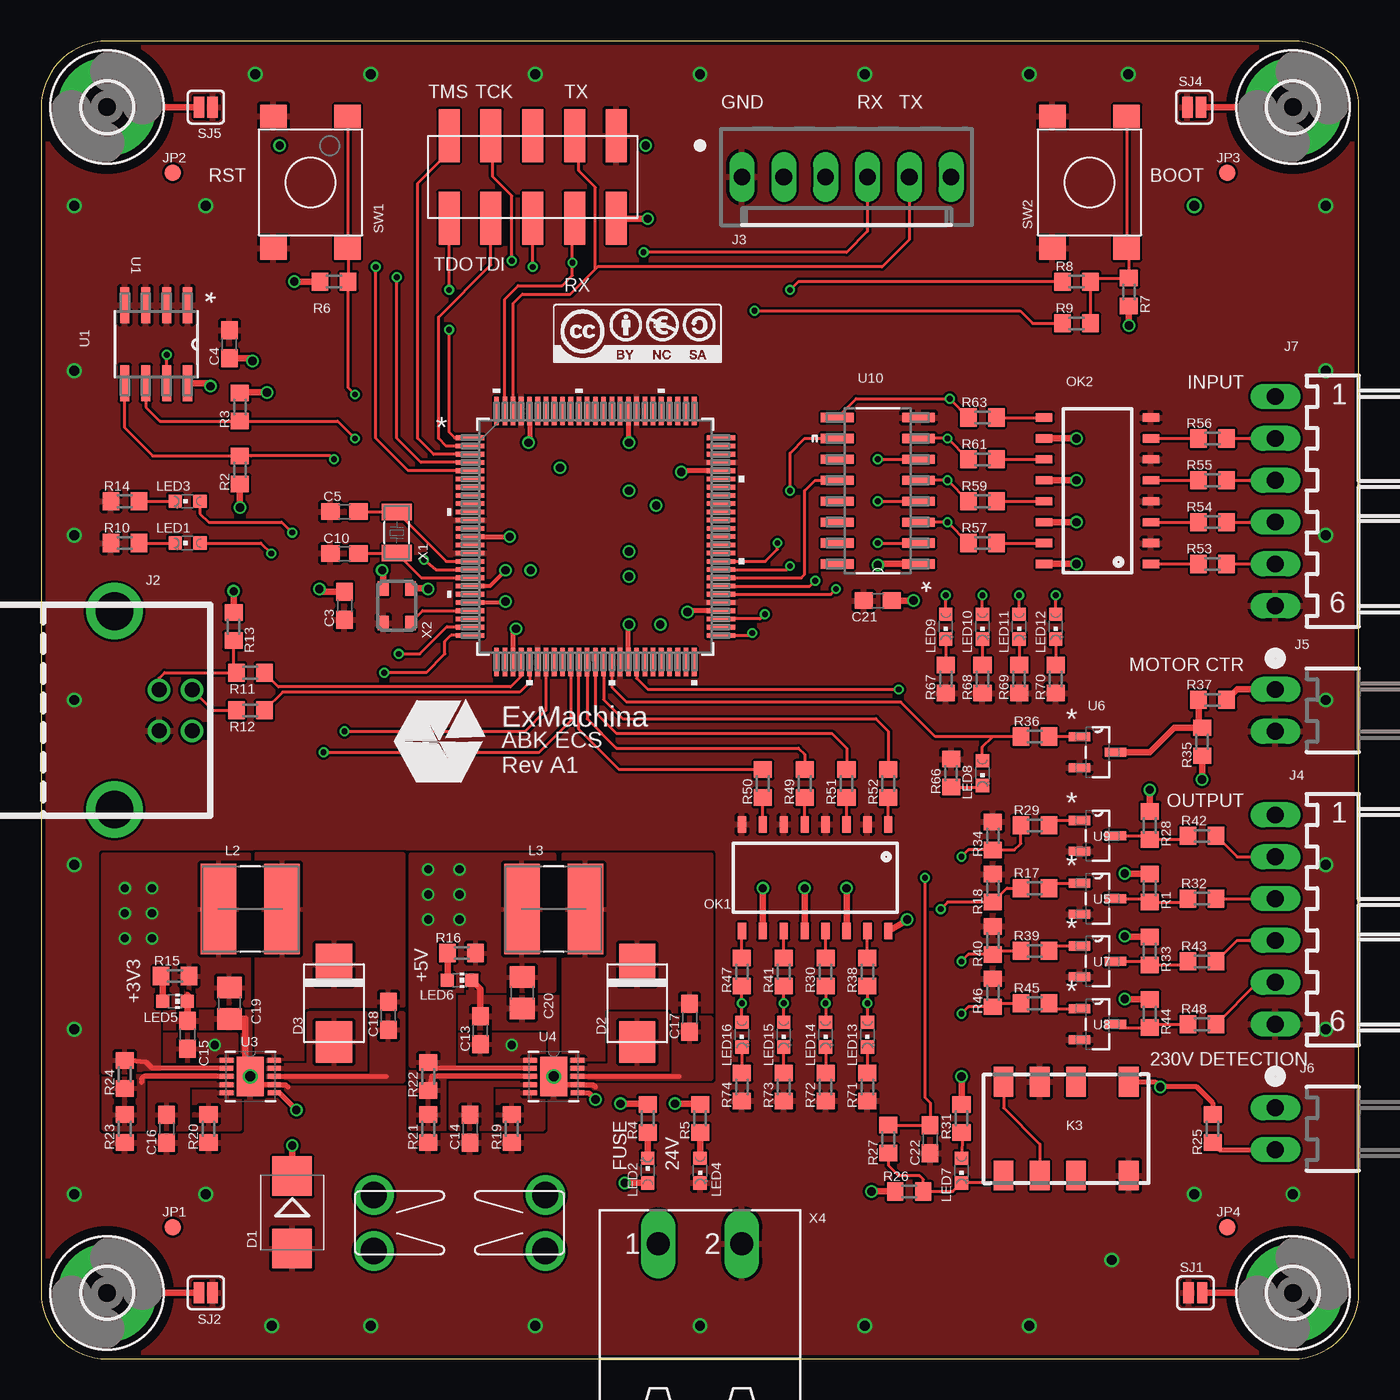
[diagram p3: board, top side]
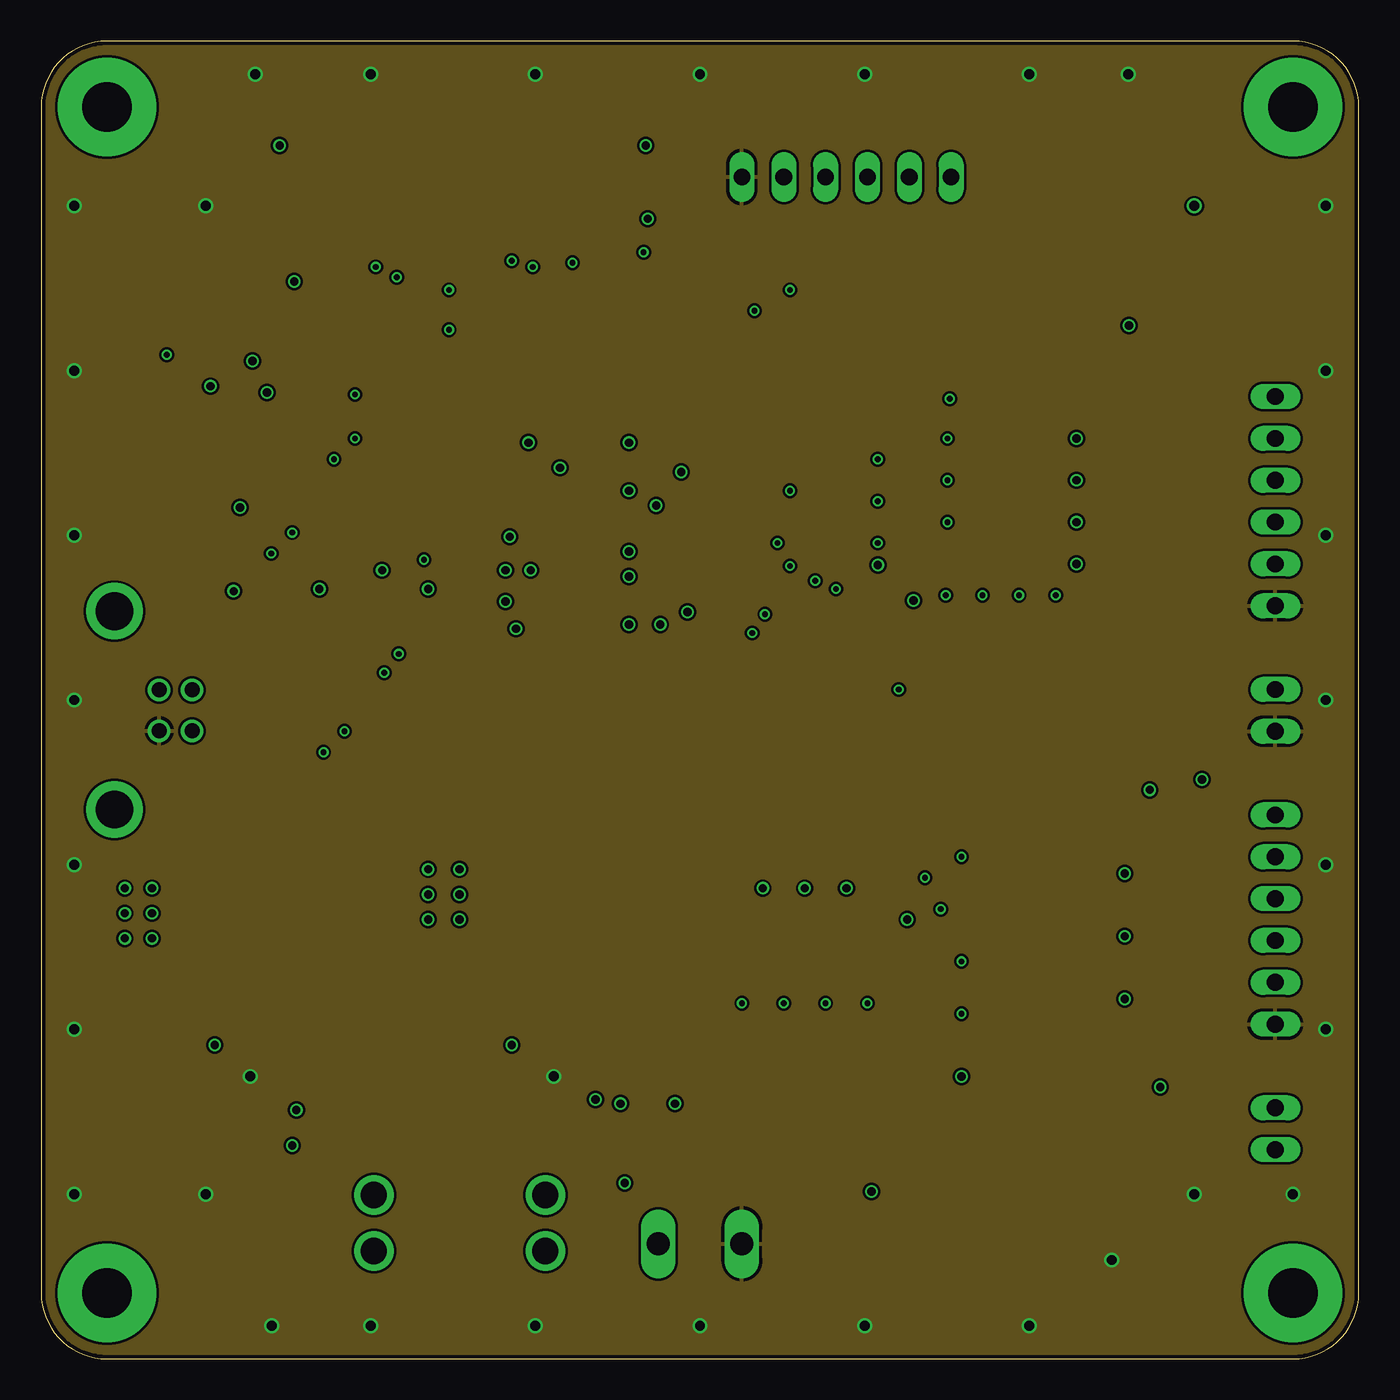
[diagram p4: board, inner layer Route2]
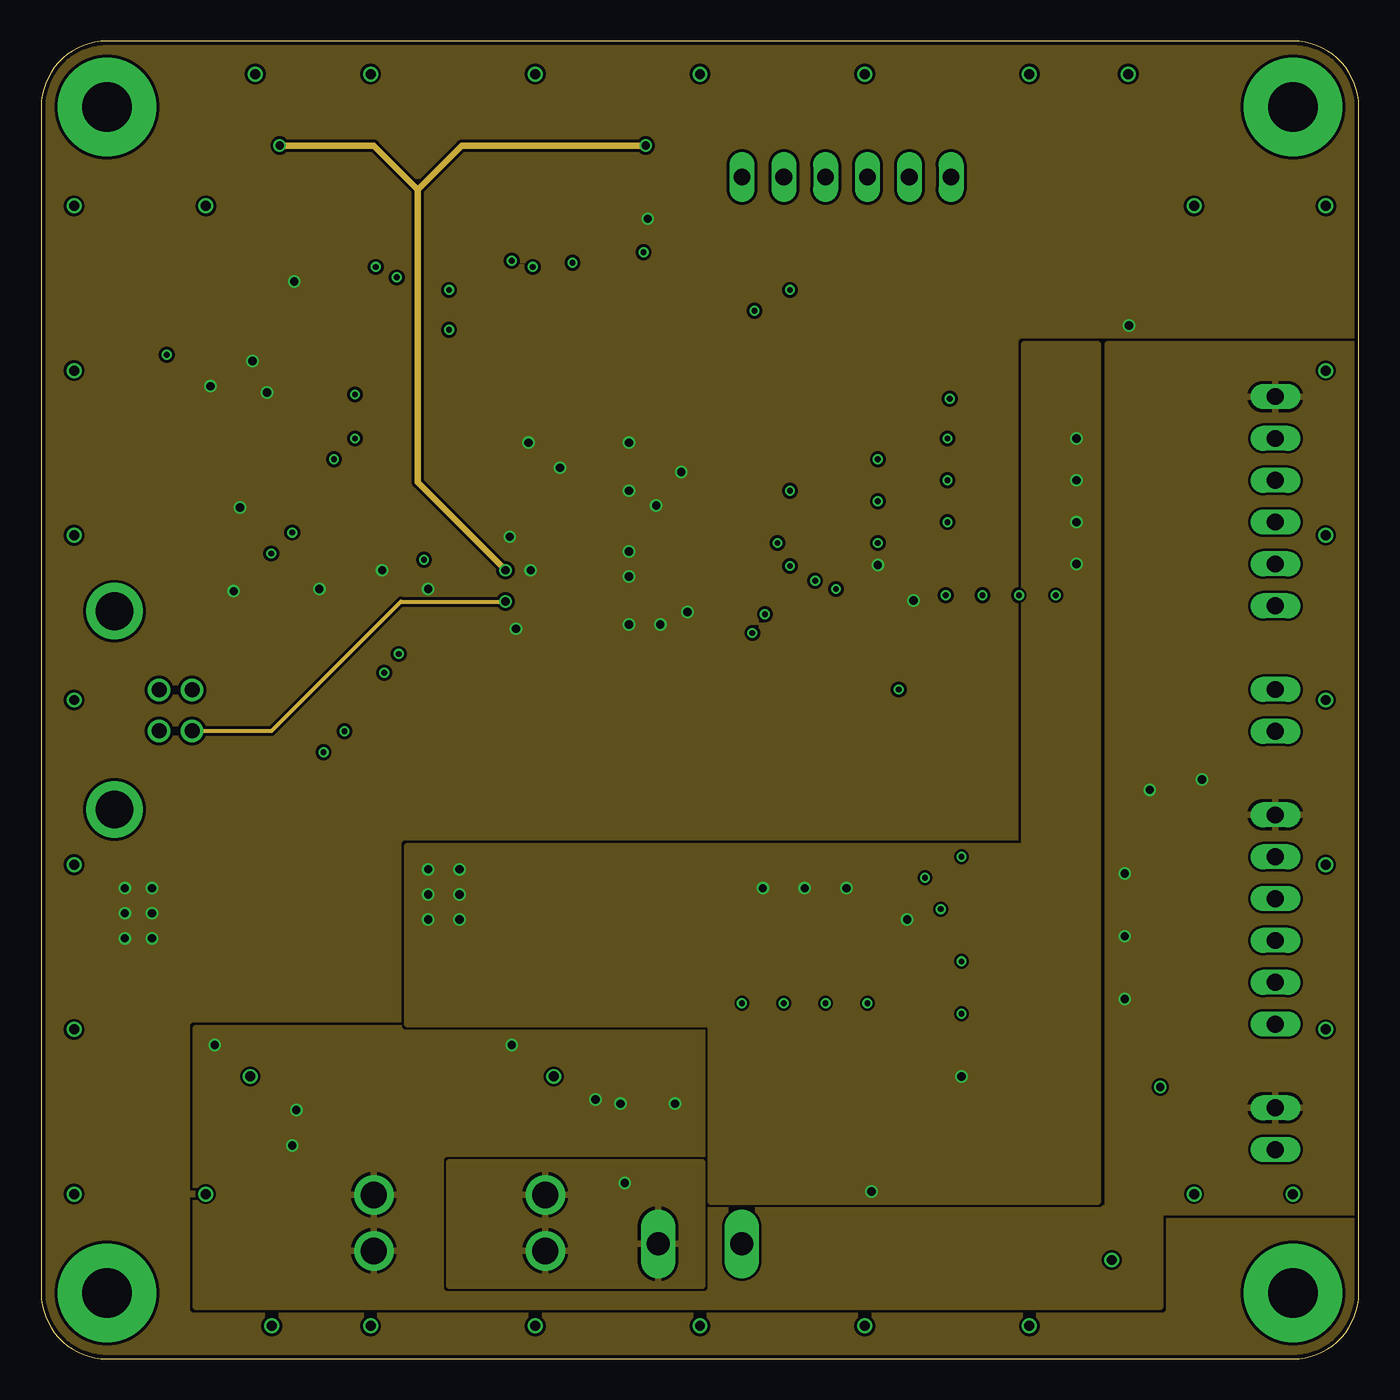
[diagram p5: board, inner layer Route15]
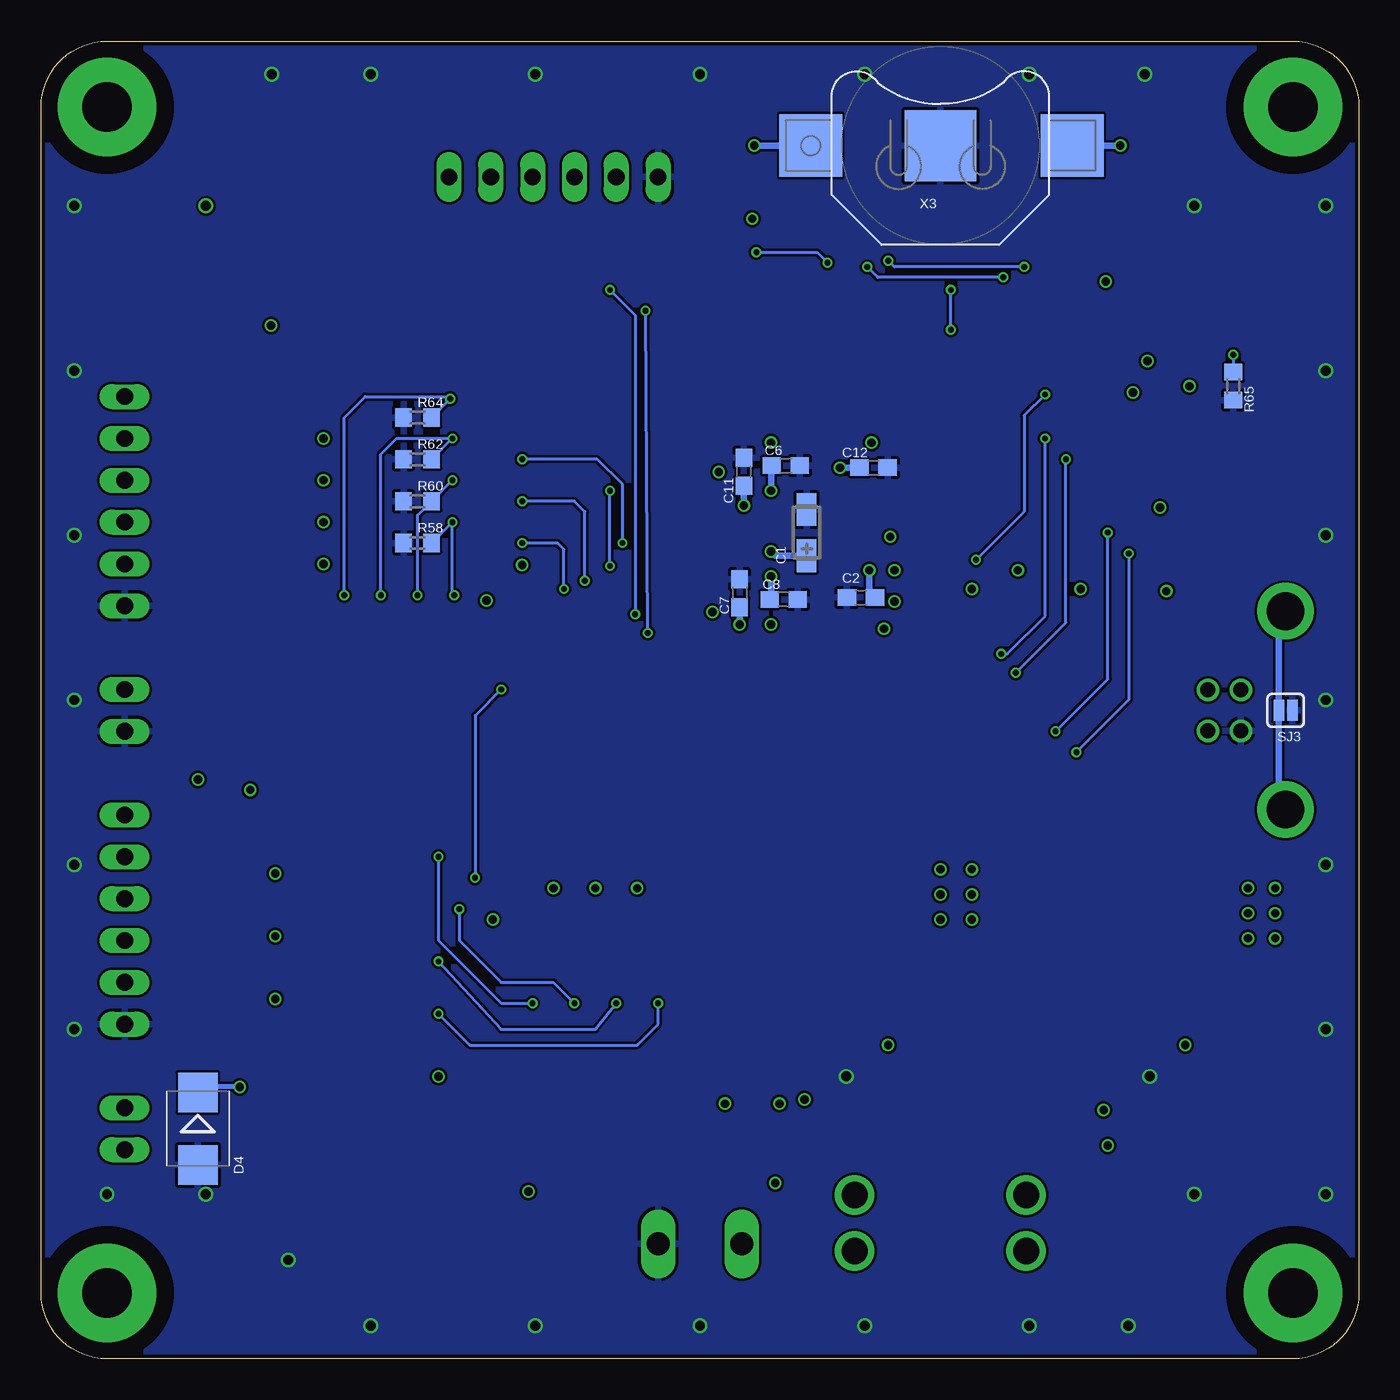
[diagram p6: board, bottom side, seen from below]

Size 80 x 80 mm. Coordinates in mm from the lower left corner, seen from the top.
Outline: 0,76 0,4 arc90 4,0 76,0 arc90 80,4 80,76 arc90 76,80 4,80 arc90 0,76
Copper layers (1+2*15+16): Top 0.018mm / dielectric 0.36mm / Route2 0.035mm / dielectric 0.71mm / Route15 0.035mm / dielectric 0.2mm / Bottom 0.018mm
Design rules "eC_4Layer_PClass6_BaseCopperO18-I35_eCDefault *": minimum track width 0.15mm, minimum drill 0.35mm, track to track 0.15mm, track to pad 0.15mm, pad to pad 0.15mm, via to via 0.15mm, smd to smd 0mil, copper to edge 0.25mm, drill to drill 0.35mm, minimum pad ring 0.175mm, minimum via ring 0.125mm, stop-mask expansion 0mil, vias tented up to drill 0.45mm, thermal gap 0.2mm

### Footprints (pad centres in the part's own frame; a part is rotated, then mirrored left to right if it is on the bottom)
CT3216 = smd 2 x 1.2: + -1.4,0; - 1.4,0
C0603 = smd 1.1 x 1: 1 -0.85,0; 2 0.85,0
C0805 = smd 1.3 x 1.5: 1 -0.95,0; 2 0.95,0
SMB = smd 2.4 x 2.4: A 2.2,0; C -2.2,0
DO-214AA = smd 2.5 x 2.2: A 2.35,0; C -2.35,0
3557-LITTLE = drill 1.6: 1 -5.207,-1.702; 2 -5.207,1.702; 3 5.207,-1.702; 4 5.207,1.702
2.54/2X5 = smd 1.27 x 3.2: 1 -5.08,2.5; 2 -5.08,-2.5; 3 -2.54,2.5; 4 -2.54,-2.5; 5 0,2.5; 6 0,-2.5; 7 2.54,2.5; 8 2.54,-2.5; 9 5.08,2.5; 10 5.08,-2.5
USB-B-S-RA = drill 0.914: 1 1.245,4.724; 2 -1.245,4.724; 3 -1.245,2.718; 4 1.245,2.718 | drill 2.286: SHL 6.02,0; SHL1 -6.02,0
6410-06 = drill 1.016 long: 1 6.35,0; 2 3.81,0; 3 1.27,0; 4 -1.27,0; 5 -3.81,0; 6 -6.35,0
7395-06 = drill 1.016 long: 1 6.35,0; 2 3.81,0; 3 1.27,0; 4 -1.27,0; 5 -3.81,0; 6 -6.35,0
7395-02 = drill 1.016 long: 1 1.27,0; 2 -1.27,0
FIDUCIAL-1X2 = smd 1 x 1: 1 0,0
G6K-2G-Y = smd 1.2 x 1.8: 1 -3.8,-2.85; 2 -0.6,-2.85; 3 1.6,-2.85; 4 3.8,-2.85; 5 3.8,2.85; 6 1.6,2.85; 7 -0.6,2.85; 8 -3.8,2.85
WE-PD2_5848/5820 = smd 2.15 x 5.5: 1 -1.925,0; 2 1.925,0
CHIPLED_0603 = smd 0.8 x 0.8: A 0,-0.75; C 0,0.75
CHIP-LED0603 = smd 0.8 x 0.8: A 0,-0.75; C 0,0.75
P3,0 = drill 3 pad 6: 1 0,0
MINI-FLAT-16 = smd 1 x 0.5: 1 -3.24,4.445; 2 -3.24,3.175; 3 -3.24,1.905; 4 -3.24,0.635; 5 -3.24,-0.635; 6 -3.24,-1.905; 7 -3.24,-3.175; 8 -3.24,-4.445; 9 3.24,-4.445; 10 3.24,-3.175; 11 3.24,-1.905; 12 3.24,-0.635; 13 3.24,0.635; 14 3.24,1.905; 15 3.24,3.175; 16 3.24,4.445
R0603 = smd 1 x 1.1: 1 -0.85,0; 2 0.85,0
SJ_2S = smd 0.635 x 1.27: 1 -0.412,0; 2 0.412,0
B3FS = smd 1.4 x 1.6: 1 4,-2.25; 2 -4,-2.25; 3 4,2.25; 4 -4,2.25
SOIC127P600X175-8N = smd 2.184 x 0.559: 1 -2.362,1.905; 2 -2.362,0.635; 3 -2.362,-0.635; 4 -2.362,-1.905; 5 2.362,-1.905; 6 2.362,-0.635; 7 2.362,0.635; 8 2.362,1.905
SOT407-1 = smd 1.727 x 0.279: 1 -7.62,6; 2 -7.62,5.5; 3 -7.62,5; 4 -7.62,4.5; 5 -7.62,4; 6 -7.62,3.5; 7 -7.62,3; 8 -7.62,2.5; 9 -7.62,2; 10 -7.62,1.5; 11 -7.62,1; 12 -7.62,0.5; 13 -7.62,0; 14 -7.62,-0.5; 15 -7.62,-1; 16 -7.62,-1.5; 17 -7.62,-2; 18 -7.62,-2.5; 19 -7.62,-3; 20 -7.62,-3.5; 21 -7.62,-4; 22 -7.62,-4.5; 23 -7.62,-5; 24 -7.62,-5.5; 25 -7.62,-6; 51 7.62,-6; 52 7.62,-5.5; 53 7.62,-5; 54 7.62,-4.5; 55 7.62,-4; 56 7.62,-3.5; 57 7.62,-3; 58 7.62,-2.5; 59 7.62,-2; 60 7.62,-1.5; 61 7.62,-1; 62 7.62,-0.5; 63 7.62,0; 64 7.62,0.5; 65 7.62,1; 66 7.62,1.5; 67 7.62,2; 68 7.62,2.5; 69 7.62,3; 70 7.62,3.5; 71 7.62,4; 72 7.62,4.5; 73 7.62,5; 74 7.62,5.5; 75 7.62,6 | smd 0.279 x 1.727: 26 -6,-7.62; 27 -5.5,-7.62; 28 -5,-7.62; 29 -4.5,-7.62; 30 -4,-7.62; 31 -3.5,-7.62; 32 -3,-7.62; 33 -2.5,-7.62; 34 -2,-7.62; 35 -1.5,-7.62; 36 -1,-7.62; 37 -0.5,-7.62; 38 0,-7.62; 39 0.5,-7.62; 40 1,-7.62; 41 1.5,-7.62; 42 2,-7.62; 43 2.5,-7.62; 44 3,-7.62; 45 3.5,-7.62; 46 4,-7.62; 47 4.5,-7.62; 48 5,-7.62; 49 5.5,-7.62; 50 6,-7.62; 76 6,7.62; 77 5.5,7.62; 78 5,7.62; 79 4.5,7.62; 80 4,7.62; 81 3.5,7.62; 82 3,7.62; 83 2.5,7.62; 84 2,7.62; 85 1.5,7.62; 86 1,7.62; 87 0.5,7.62; 88 0,7.62; 89 -0.5,7.62; 90 -1,7.62; 91 -1.5,7.62; 92 -2,7.62; 93 -2.5,7.62; 94 -3,7.62; 95 -3.5,7.62; 96 -4,7.62; 97 -4.5,7.62; 98 -5,7.62; 99 -5.5,7.62; 100 -6,7.62
DFN300X300X80-11N = smd 0.813 x 0.305: 1 -1.448,0.991; 2 -1.448,0.508; 3 -1.448,0; 4 -1.448,-0.508; 5 -1.448,-0.991; 6 1.448,-0.991; 7 1.448,-0.508; 8 1.448,0; 9 1.448,0.508; 10 1.448,0.991 | smd 1.651 x 2.388: 11 0,0
SOT95P240X112-3N = smd 1.321 x 0.559: 1 -1.092,0.94; 2 -1.092,-0.94; 3 1.092,0
SOIC127P600X175-16N = smd 1.981 x 0.559: 1 -2.464,4.445; 2 -2.464,3.175; 3 -2.464,1.905; 4 -2.464,0.635; 5 -2.464,-0.635; 6 -2.464,-1.905; 7 -2.464,-3.175; 8 -2.464,-4.445; 9 2.464,-4.445; 10 2.464,-3.175; 11 2.464,-1.905; 12 2.464,-0.635; 13 2.464,0.635; 14 2.464,1.905; 15 2.464,3.175; 16 2.464,4.445
FC-135 = smd 1 x 1.8: 1 -1.25,0; 2 1.25,0
ASE = smd 0.9 x 0.65: 1 -1.05,-0.825; 2 1.05,-0.825; 3 1.05,0.825; 4 -1.05,0.825
3000 = smd 3.81 x 3.81: +1 -7.874,0; +2 8.001,0 | smd 4.318 x 4.318: - 0,0
MSTBA2 = drill 1.397 long: 1 -2.54,5.08; 2 2.54,5.08

### Placement (x,y rotation side)
C1  33.53,50.16 90 bottom
C2  30.23,46.23 180 bottom
C3  18.41,45.72 270 top
C4  11.43,61.59 90 top
C5  18.41,51.44 180 top
C6  34.8,54.23 0 bottom
C7  37.59,46.48 90 bottom
C8  34.92,46.1 0 bottom
C10  18.41,48.9 180 top
C11  37.34,53.85 90 bottom
C12  29.46,54.1 0 bottom
C13  26.67,19.94 90 top
C14  26.04,13.97 270 top
C15  8.89,19.68 90 top
C16  7.62,13.97 270 top
C17  39.37,20.7 90 top
C18  21.08,20.83 90 top
C19  11.43,21.59 270 top
C20  29.21,22.23 270 top
C21  50.8,46.04 180 top
C22  53.98,13.34 270 top
CC1  36.2,62.23 0 top
D1  15.24,8.89 270 top
D2  36.2,21.59 270 top
D3  17.78,21.59 270 top
D4  70.48,13.97 270 bottom
F1  25.4,8.26 180 top
J1  29.84,71.75 180 top
J2  4.45,39.37 270 top
J3  48.9,71.75 180 top
J4  74.93,26.67 90 top
J5  74.93,39.37 90 top
J6  74.93,13.97 90 top
J7  74.93,52.07 90 top
JP1  8,8 0 top
JP2  8,72 0 top
JP3  72,72 0 top
JP4  72,8 0 top
K3  62.23,13.97 180 top
L2  12.7,27.3 180 top
L3  31.11,27.3 180 top
LED1  8.89,49.53 90 top
LED2  36.83,11.43 0 top
LED3  8.89,52.07 90 top
LED4  40.01,11.43 180 top
LED5  8.13,21.72 270 top
LED6  25.4,22.99 270 top
LED7  55.88,11.43 180 top
LED8  57.15,35.56 180 top
LED9  54.93,44.45 180 top
LED10  57.15,44.45 180 top
LED11  59.37,44.45 180 top
LED12  61.59,44.45 180 top
LED13  50.16,19.68 180 top
LED14  47.62,19.68 180 top
LED15  45.09,19.68 180 top
LED16  42.55,19.68 180 top
MP1  4,4 0 top
MP2  4,76 0 top
MP3  76,76 0 top
MP4  76,4 0 top
OK1  46.99,29.21 270 top
OK2  64.14,52.7 180 top
R1  67.31,28.57 90 top
R2  12.06,53.98 270 top
R3  12.06,57.78 90 top
R4  36.83,14.61 90 top
R5  40.01,14.61 90 top
R6  17.78,65.41 180 top
R7  66.04,64.77 270 top
R8  62.87,65.41 0 top
R9  62.87,62.87 0 top
R10  5.08,49.53 180 top
R11  12.7,41.66 0 top
R12  12.7,39.37 0 top
R13  11.68,44.45 270 top
R14  5.08,52.07 180 top
R15  8.13,23.24 0 top
R16  25.53,24.64 0 top
R17  60.33,28.57 0 top
R18  57.78,28.57 90 top
R19  28.57,13.97 90 top
R20  10.16,13.97 90 top
R21  23.5,13.97 90 top
R22  23.5,17.14 90 top
R23  5.08,13.97 90 top
R24  5.08,17.27 90 top
R25  71.12,13.97 90 top
R26  52.7,10.16 0 top
R27  51.44,13.34 90 top
R28  67.31,32.38 90 top
R29  60.33,32.38 0 top
R30  47.62,23.5 90 top
R31  55.88,14.61 90 top
R32  70.48,27.94 0 top
R33  67.31,24.77 90 top
R34  57.78,31.75 90 top
R35  70.48,37.47 270 top
R36  60.33,37.78 180 top
R37  71.12,40.01 180 top
R38  50.16,23.5 90 top
R39  60.33,24.77 0 top
R40  57.78,25.4 90 top
R41  45.09,23.5 90 top
R42  70.48,31.75 0 top
R43  70.48,24.13 0 top
R44  67.31,20.95 90 top
R45  60.33,21.59 0 top
R46  57.78,22.23 90 top
R47  42.55,23.5 90 top
R48  70.48,20.32 0 top
R49  46.35,34.92 90 top
R50  43.81,34.92 90 top
R51  48.9,34.92 90 top
R52  51.44,34.92 90 top
R53  71.12,48.26 180 top
R54  71.12,50.8 180 top
R55  71.12,53.34 180 top
R56  71.12,55.88 180 top
R57  57.15,49.53 180 top
R58  57.15,49.53 180 bottom
R59  57.15,52.07 180 top
R60  57.15,52.07 180 bottom
R61  57.15,54.61 180 top
R62  57.15,54.61 180 bottom
R63  57.15,57.15 180 top
R64  57.15,57.15 180 bottom
R65  7.62,59.05 270 bottom
R66  55.24,35.56 90 top
R67  54.93,41.27 270 top
R68  57.15,41.27 270 top
R69  59.37,41.27 270 top
R70  61.59,41.27 270 top
R71  50.16,16.51 270 top
R72  47.62,16.51 270 top
R73  45.09,16.51 270 top
R74  42.55,16.51 270 top
SJ1  70.08,4 0 top
SJ2  10,4 180 top
SJ3  4.45,39.37 180 bottom
SJ4  70,76 0 top
SJ5  10,76 180 top
SW1  16.35,71.43 270 top
SW2  63.65,71.43 270 top
T1  24.13,37.47 0 top
U1  6.99,61.59 270 top
U2  33.65,49.92 0 top
U3  12.7,17.14 0 top
U4  31.11,17.14 0 top
U5  64.14,27.94 0 top
U6  64.14,36.83 0 top
U7  64.14,24.13 0 top
U8  64.14,20.32 0 top
U9  64.14,31.75 0 top
U10  50.8,52.7 180 top
X1  21.59,50.16 270 top
X2  21.59,45.72 270 top
X3  25.4,73.66 0 bottom
X4  40,1.91 0 top

### Tracks (layer width: path | path; a pad name or v marks a point on that pad's centre or on a via)
1
  Top 0.406: MP1.1 SJ2.2
2
  Top 0.406: MP2.1 SJ5.2
3
  Top 0.406: MP3.1 SJ4.2
4
  Top 0.406: MP4.1 SJ1.2
230V-DETECTION  (via drill 0.35)
  Top 0.178: R27.2 C22.1 53.98,15.56 53.66,15.88 v53.66,29.21 | v52.07,40.64 36.83,40.64 36.15,41.32 U2.43
  Bottom 0.178: v52.07,40.64 53.66,39.05 v53.66,29.21
230V_DETECTION_MCU
  Top 0.178: U2.58 46.15,47.42 46.35,47.62 46.35,52.7 46.99,53.34 U10.12
!JTAG_TRST  (via drill 0.35)
  Top 0.178: U2.4 23.05,54.42 21.59,55.88 v21.59,65.66 | v29.84,66.29 J1.5
  Bottom 0.178: v21.59,65.66 29.21,65.66 v29.84,66.29
!RESET  (via drill 0.35)
  Top 0.178: SW1.4 SW1.3 18.63,67.4 R6.1 18.63,58.97 v19.05,58.55 | v23.24,48.51 23.96,47.92 U2.17
  Bottom 0.178: v19.05,58.55 20.32,57.28 20.32,51.44 v23.24,48.51
+3V3  (via drill 0.5)
  Top 0.305: U3.2 6.73,17.65 6.39,18 R24.2 | U2.42 35.65,44.54 v35.69,44.58 | U2.54 39.32,45.42 v39.24,45.34 | U2.13 v28.44,49.92 v28.45,49.91 | U2.96 29.65,55.69 v29.59,55.63 | U2.84 35.65,55.66 v35.69,55.63 | U2.71 38.93,53.92 v38.86,53.85 | U2.28 28.65,44.14 v28.83,44.32
  Top 0.406: U1.8 10.11,59.23 v10.29,59.05 | C4.1 12.66,60.74 v12.83,60.58 | C3.1 17.06,46.57 v16.89,46.74 | X2.1 20.77,47.81 v20.7,47.88 | X2.4 23.46,46.77 v23.5,46.74 | R7.2 v66.04,62.74 | R6.2 v15.37,65.41 | U10.1 51.04,48.27 50.88,48.27 v50.8,48.2 | C21.1 v52.96,46.04 | J1.1 34.97,69.22 v36.83,69.22 | R2.2 v12.06,51.69 | R13.1 v11.68,46.61 | R3.2 12.1,58.67 v13.72,58.67
  Bottom 0.254: C2.1 29.34,46.27
  Bottom 0.406: C7.1 v37.59,44.58 | C12.1 v31.5,54.1 | C6.1 35.69,54.19 v35.69,52.7 | C11.1 v37.34,51.82 | C8.1 35.69,46.19 v35.69,47.5 | C1.+ 35.43,48.77 v35.69,49.02 | 29.34,46.27 29.72,46.65 v29.72,47.88
  other vias: 5.08,28.57 5.08,27.05 5.08,25.53 6.73,27.05 6.73,28.57 6.73,25.53
  pour Route15 (isolate 0.178, rank 6): -12.06,-8.89 94.61,-8.89 94.61,88.9 -12.06,88.9
  pour Top: 3.81,17.4 3.81,30.61 12.57,30.61 12.57,21.46 7.11,21.46 7.11,17.4
+5V  (via drill 0.5)
  Top 0.305: U4.2 23.84,17.65 R22.2
  Top 0.406: OK1.16 52.51,26.61 v52.58,26.67 | R31.2 v55.88,17.14 | R26.1 v50.42,10.16 | OK1.10 v43.81,28.57 | OK1.12 v46.35,28.57 | OK1.14 v48.9,28.57 | OK2.10 v62.87,55.88 | OK2.12 v62.87,53.34 | OK2.14 v62.87,50.8 | OK2.16 v62.87,48.26
  other vias: 23.5,29.72 23.5,28.19 23.5,26.67 25.4,26.67 25.4,28.19 25.4,29.72
  pour Top: 22.48,30.61 31.11,30.61 31.11,22.35 25.02,22.35 25.02,17.78 22.48,17.78
  pour Route15 (rank 2): 22.23,31.11 59.69,31.11 59.69,61.59 64.14,61.59 64.14,9.53 40.64,9.53 40.64,20.32 22.23,20.32
+24V  (via drill 0.5)
  Top 0.305: U3.6 14.45,16.15 v15.49,15.11 | U4.6 33.25,16.15 v33.66,15.75
  Top 0.406: D1.C v15.24,12.95 | v65.79,25.65 65.83,25.61 R33.2 | R44.2 67.27,21.84 v65.79,21.84 | R1.2 67.27,29.46 v65.79,29.46 | R28.2 v67.31,34.54 | R35.2 v70.48,35.18 | R4.2 36.79,15.49 v35.18,15.49 | R5.2 39.97,15.49 v38.48,15.49
  other vias: 10.54,19.05 28.57,19.05
  pour Route15: 82.55,8.89 64.77,8.89 64.77,24.77 64.77,61.59 81.28,61.59 82.55,61.59
  pour Top (rank 2): 7.37,19.68 11.81,19.68 11.81,17.91 7.37,17.91
  pour Route15 (rank 3): 67.94,3.17 9.4,3.17 9.4,20.07 40.51,20.07 40.51,9.14 67.94,9.14
  pour Top (rank 3): 25.4,19.68 30.48,19.68 30.48,17.91 25.4,17.91
BOOT_SELECT_P2_10  (via drill 0.35)
  Top 0.178: R8.1 45.97,65.41 v45.47,64.9 | v43.94,45.21 43.65,44.92 U2.53
  Bottom 0.178: v45.47,64.9 43.94,63.37 v43.94,45.21
BOOT_SELECT_P2_12  (via drill 0.35)
  Top 0.178: U2.51 43.03,43.92 v43.18,44.07 | v43.31,63.63 59.44,63.63 60.2,62.87 R9.1
  Bottom 0.178: v43.18,44.07 v43.31,63.63
BRAKE_CONTROL
  Top 0.178: R48.2 73.88,22.86 J4.5
BRAKE_CONTROL_MCU
  Top 0.178: R50.2 35.09,35.77 32.65,38.22 U2.36
CLUTCH_CONTROL
  Top 0.178: R43.2 72.61,25.4 J4.4
CLUTCH_CONTROL_MCU
  Top 0.178: U2.37 33.15,38.86 34.92,37.08 45.97,37.08 46.35,36.7 R49.2
DRIVE_STATUS_1  (via drill 0.35)
  Top 0.178: U10.7 v55.03,55.88 R62.1 | LED11.A v59.37,46.35
  Bottom 0.178: R62.1 v55.03,55.88 58.42,55.88 59.37,54.93 v59.37,46.35
DRIVE_STATUS_1_MCU  (via drill 0.35)
  Top 0.178: U2.60 43.98,48.42 44.7,49.15 v44.7,49.53 | v50.8,54.61 U10.6
  Bottom 0.178: v44.7,49.53 44.7,53.09 46.23,54.61 v50.8,54.61
DRIVE_STATUS_2  (via drill 0.35)
  Top 0.178: U10.9 49.48,58.29 v55.16,58.29 R64.1 | LED12.A v61.59,46.35
  Bottom 0.178: R64.1 v55.16,58.29 55.28,58.42 60.33,58.42 61.59,57.15 v61.59,46.35
DRIVE_STATUS_2_MCU  (via drill 0.35)
  Top 0.178: U2.59 45.25,47.92 v45.47,48.13 | v45.47,52.7 45.47,54.99 46.35,55.88 U10.10
  Bottom 0.178: v45.47,48.13 v45.47,52.7
EEPROM_SCL  (via drill 0.35)
  Top 0.178: U1.6 6.35,57.78 7.2,56.94 R3.1 18,56.94 v19.05,55.88 | U2.24 26,44.45 24.64,44.45 22.99,42.8 v21.72,42.8
  Bottom 0.178: v19.05,55.88 19.05,45.09 21.34,42.8 v21.72,42.8
EEPROM_SDA  (via drill 0.35)
  Top 0.178: U1.5 5.08,56.52 6.77,54.83 R2.1 | U2.25 24.87,43.92 24.51,43.56 24.51,42.8 23.37,41.66 v20.83,41.66 | 12.74,54.83 R2.1 | v17.78,54.61 17.57,54.83 R2.1
  Bottom 0.178: v17.78,54.61 17.78,44.7 v20.83,41.66
EMERGENCY_STOP  (via drill 0.35)
  Top 0.178: U10.3 v55.03,50.8 R58.1 | LED9.A v54.93,46.35
  Bottom 0.178: R58.1 v55.03,50.8 55.03,46.46 v54.93,46.35
EMERGENCY_STOP_MCU  (via drill 0.35)
  Top 0.178: U2.56 47.94,46.42 v48.26,46.74 | v50.8,49.53 U10.2
  Bottom 0.178: v48.26,46.74 48.26,49.15 48.64,49.53 v50.8,49.53
GND  (via drill 0.6)
  Top 0.305: 14.99,16.51 14.86,16.64 U3.7 13.21,16.64 U3.11 | 33.66,16.51 33.53,16.64 U4.7 31.62,16.64 U4.11
  Top 0.406: LED5.C 8.89,22.09 C15.2 | LED6.C 26.67,22.47 C13.2 | C19.2 12.38,20.64 12.38,17.14 U3.11
  other vias: 2,10 10,10 13,78 14,2 20,2 30,2 40,2 50,2 60,2 65,6 70,10 76,10 78,20 78,30 78,40 78,50 78,60 78,70 60,78 66,78 50,78 40,78 30,78 20,78 10,70 2,70 2,60 2,50 2,40 2,30 2,20 12.7,17.14 31.11,17.14
  pour Top (rank 6): -9.53,-6.35 92.08,-6.35 92.08,77.47 92.08,86.36 -3.17,86.36 -9.53,86.36
  pour Bottom: -13.34,-10.16 95.89,-10.16 95.89,90.17 -13.34,90.17
  pour Route2: -10.79,-7.62 93.34,-7.62 93.34,87.63 -10.79,87.63
  pour Top (rank 6): 7.11,19.94 7.11,21.59 13.97,21.59 13.97,15.88 12.06,15.88 12.06,19.81 7.11,19.81
ISP_RXDO  (via drill 0.35)
  Top 0.178: U2.99 28.15,64.34 28.96,65.15 31.62,65.15 32.26,65.79 v32.26,66.55 32.26,69.13 J1.3 | J3.4 50.16,68.45 48.9,67.18 v36.58,67.18
  Bottom 0.178: v36.58,67.18 32.89,67.18 v32.26,66.55
ISP_TXDO
  Top 0.178: U2.98 28.65,64.08 29.21,64.64 32.13,64.64 33.59,66.1 33.66,66.17 | 33.66,66.17 33.66,71.12 32.64,72.14 32.64,74 J1.4 | J3.5 52.7,67.94 51.05,66.29 33.78,66.29 33.66,66.17
JTAG_TCK  (via drill 0.35)
  Top 0.178: U2.5 22.28,53.92 20.32,55.88 v20.32,66.29 | v28.57,66.67 28.57,70.61 27.43,71.75 27.43,74.13 J1.8
  Bottom 0.178: v20.32,66.29 28.19,66.29 v28.57,66.67
JTAG_TDI
  Top 0.178: U2.2 24.59,55.42 24.13,55.88 24.13,63.25 27.3,66.42 J1.7
JTAG_TDO  (via drill 0.35)
  Top 0.178: U2.1 25.11,55.92 24.77,56.26 v24.77,62.48 | v24.77,64.9 J1.9
  Bottom 0.178: v24.77,62.48 v24.77,64.9
JTAG_TMS
  Top 0.178: U2.3 23.82,54.92 22.86,55.88 22.86,71.37 24.77,73.28 J1.10
L_VALIDATION
  Top 0.178: R32.2 J4.3
L_VALIDATION_MCU
  Top 0.178: U2.38 33.65,39.25 34.92,37.97 48.01,37.97 48.9,37.08 R51.2
LED_DEBUG  (via drill 0.35)
  Top 0.178: U2.35 32.15,38.73 30.25,36.83 v17.14,36.83 | LED1.A 13.34,49.53 v13.97,48.9
  Bottom 0.178: v13.97,48.9 13.97,40.01 v17.14,36.83
LIMIT_SWITCH  (via drill 0.35)
  Top 0.178: U10.5 v55.03,53.34 R60.1 | LED10.A v57.15,46.35
  Bottom 0.178: v55.03,53.34 R60.1 57.15,51.22 v57.15,46.35
LIMIT_SWITCH_MCU  (via drill 0.35)
  Top 0.178: U2.57 46.67,46.92 v46.99,47.24 | v50.8,52.07 U10.4
  Bottom 0.178: v46.99,47.24 46.99,51.44 47.62,52.07 v50.8,52.07
MOTOR_CONTROL_MCU
  Top 0.178: U2.40 34.65,40.79 35.56,39.88 52.2,39.88 54.29,37.78 57.78,37.78 | R36.2 57.78,37.78 | LED8.A 57.15,37.15 57.78,37.78
N$1
  Top 0.178: J2.3 7.16,41.33 7.49,41.66 R11.1 11.68,41.82 R13.2
N$2
  Top 0.178: J2.2 10.41,39.37 R12.1
N$3
  Top 0.178: R14.1 LED3.C
N$4
  pour Top (rank 4): 27.3,13.97 30.48,13.97 30.48,16.51 27.3,16.51
N$5
  Top 0.178: R9.2 R8.2 63.93,65.62 R7.1 66.04,67.29 SW2.3 SW2.4
N$6
  pour Top (rank 2): 27.3,13.97 24.89,13.97 24.89,16.76 30.23,16.76 30.23,16.64 27.3,16.64
N$7
  pour Top (rank 4): 8.89,13.97 12.06,13.97 12.06,16.64 9.02,16.64
N$8
  pour Top (rank 2): 6.6,13.97 8.89,13.97 8.89,16.64 12.06,16.64 12.06,16.89 6.6,16.89
N$9
  Top 0.305: U4.3 23.71,17.14 R22.1
  pour Top (rank 3): 24.77,13.97 22.48,13.97 22.48,18.41 24.77,18.41 24.77,17.4 30.23,17.4 30.23,17.02 24.77,17.02
N$10
  Top 0.305: U4.8 38.73,17.14
  pour Top (rank 2): 32,17.27 38.35,17.27 38.35,20.7 40.64,20.7 40.64,17.02 32,17.02
N$11
  pour Top (rank 5): 31.75,30.61 40.64,30.61 40.64,20.95 34.29,20.95 34.29,17.91 31.75,17.91
N$12
  pour Top: 32,17.78 34.54,17.78 34.54,20.95 37.97,20.95 37.97,17.27 32,17.27
N$13
  Top 0.305: U3.3 6.22,17.14 6.1,17.02 6.1,16.76 | 5.08,16.51 R24.1
  pour Top (rank 3): 3.81,13.97 6.48,13.97 6.48,17.14 11.81,17.14 11.81,17.4 6.48,17.53 3.81,17.53
N$14
  Top 0.305: U3.8 20.95,17.14
  pour Top (rank 2): 19.94,20.95 19.94,17.27 13.72,17.27 13.72,16.89 21.97,16.89 21.97,20.95
N$15
  pour Top (rank 5): 13.08,17.91 16,17.91 16.13,21.46 21.97,21.46 21.97,30.61 13.08,30.61
N$16
  pour Top: 16.26,20.95 16.26,17.78 13.59,17.78 13.59,17.4 19.68,17.4 19.68,20.95
N$17
  Top 0.178: U5.3 67.09,27.94 R1.1 69.42,27.73 R32.1
N$18
  Top 0.178: U9.3 67.09,31.75 R28.1 69.42,31.54 R42.1
N$19
  Top 0.178: R29.2 61.48,32.69 U9.1
N$20  (via drill 0.35)
  Top 0.178: R29.1 59.48,31.28 59.09,30.9 R34.1 56.3,30.9 v55.88,30.48 | R38.1 v50.16,21.59 LED13.A
  Bottom 0.178: v50.16,21.59 52.07,21.59 55.88,25.4 v55.88,30.48
N$21
  Top 0.178: R38.2 OK1.15
N$22
  Top 0.178: R17.2 61.48,28.88 U5.1
N$23
  Top 0.178: U6.1 63.03,37.78 R36.1
N$24
  Top 0.406: U6.3 67.31,36.83 68.8,38.31 R35.1 70.27,38.53 R37.2
N$25  (via drill 0.35)
  Top 0.178: R17.1 58.63,28.57 R18.1 55.03,27.73 v54.61,27.3 | R30.1 v47.62,21.59 LED14.A 47.62,20.32
  Bottom 0.178: v54.61,27.3 54.61,25.4 52.07,22.86 48.9,22.86 v47.62,21.59
N$26
  Top 0.406: J5.1 72.61,40.64 R37.1
N$27  (via drill 0.35)
  Top 0.178: U1.7 v7.62,60.96
  Bottom 0.178: v7.62,60.96 R65.1
N$28  (via drill 0.5)
  Top 0.305: R25.2 71.12,15.54 70.14,16.51 v67.94,16.51 67.64,16.82 K3.1
  Bottom 0.305: v67.94,16.51 70.14,16.51 D4.C
N$29
  Top 0.178: R10.1 LED1.C
N$30
  Top 0.178: R30.2 OK1.13
N$31
  Top 0.178: U7.3 67.09,24.13 R33.1 69.42,23.91 R43.1
N$32
  Top 0.305: R25.1 71.54,12.7 J6.2
N$33
  Top 0.178: R39.2 61.48,25.07 U7.1
N$34  (via drill 0.35)
  Top 0.178: R39.1 58,24.77 R40.1 56.3,24.55 v55.88,24.13 | LED15.A v45.09,21.59 R41.1
  Bottom 0.178: v55.88,24.13 52.07,20 46.35,20 v45.09,21.59
N$35
  Top 0.178: U8.3 65.44,20.11 R44.1 67.53,20.32 R48.1
N$36
  Top 0.178: R45.2 61.51,21.26 U8.1
N$37  (via drill 0.35)
  Top 0.178: R45.1 58,21.59 R46.1 56.3,21.38 v55.88,20.95 | LED16.A v42.55,21.59 R47.1
  Bottom 0.178: v55.88,20.95 53.98,19.05 43.81,19.05 42.55,20.32 v42.55,21.59
N$38
  Top 0.178: R41.2 OK1.11
N$39
  Top 0.178: R47.2 OK1.9
N$40
  Top 0.178: OK1.1 R52.1
N$41
  Top 0.178: OK2.1 R53.2
N$42
  Top 0.178: OK1.3 R51.1
N$43
  Top 0.178: OK1.7 R50.1
N$44
  Top 0.406: R5.1 LED4.A
N$45
  Top 0.406: LED2.C R4.1
N$46
  Top 0.178: OK1.5 R49.1
N$47
  Top 0.178: OK2.3 R54.2
N$48
  Top 0.178: OK2.5 R55.2
N$49
  Top 0.178: OK2.7 R56.2
N$50
  Top 0.406: R15.1 7.38,23.14 LED5.A
N$51
  Top 0.406: LED6.A 24.68,23.01 R16.1
N$52
  Top 0.178: R56.1 J7.2
N$53
  Top 0.178: R55.1 J7.3
N$54
  Top 0.178: R54.1 J7.4
N$55
  Top 0.178: R53.1 J7.5
N$56
  Top 0.178: R66.1 57.05,34.71 LED8.C
N$57
  Top 0.178: LED9.C R67.1
N$58
  Top 0.178: LED10.C R68.1
N$59
  Top 0.178: LED11.C R69.1
N$60
  Top 0.178: K3.4 58.43,15.23 60.63,13.03 K3.6
N$61
  Top 0.178: R63.1 OK2.9
N$62
  Top 0.178: R61.1 OK2.11
N$63
  Top 0.178: R59.1 OK2.13
N$64
  Top 0.178: R57.1 OK2.15
N$65
  Top 0.178: LED12.C R70.1
N$66
  Top 0.178: LED13.C R71.1
N$67
  Top 0.178: LED14.C R72.1
N$68
  Top 0.178: R73.1 LED15.C
N$69
  Top 0.178: LED16.C R74.1
N$70
  Bottom 0.406: J2.SHL 4.86,33.76 SJ3.2 4.86,44.98 J2.SHL1
N$73
  Top 0.178: 53.55,9.74 R26.2 | R26.2 55.36,10.16 LED7.C 57.99,10.68 K3.5 | R27.1 51.44,11.75 51.59,11.59 52.07,11.11 53.34,11.11 53.55,10.9 R26.2
N$74
  Top 0.178: LED7.A 55.99,13.64 R31.1
N$90  (via drill 0.6)
  other vias: 70,70
R_VALIDATION
  Top 0.178: R42.2 72.61,30.48 J4.2
R_VALIDATION_MCU
  Top 0.178: U2.39 34.15,40.02 35.31,38.86 50.67,38.86 51.44,38.1 R52.2
RTCX1
  Top 0.178: C5.1 19.29,51.41 X1.1 24.59,48.42 U2.16
RTCX2
  Top 0.178: C10.1 19.29,48.91 X1.2 23.09,47.42 U2.18
USB_D_N
  Top 0.178: U2.30 29.65,41.08 29.05,40.48 14.66,40.48 R12.2
USB_D_P
  Top 0.178: U2.29 29.15,41.45 28.51,40.8 14.4,40.8 R11.2
USB_UP_LED  (via drill 0.35)
  Top 0.178: U2.32 30.65,39.37 29.38,38.1 v18.41,38.1 | LED3.A 9.64,51.32 10.16,50.8 14.61,50.8 v15.24,50.16
  Bottom 0.178: v18.41,38.1 15.24,41.27 v15.24,50.16
USB_V_BUS  (via drill 0.5)
  Top 0.254: U2.21 28.14,45.92 v28.19,45.97
  Route15 0.254: J2.1 13.99,38.12 21.84,45.97 v28.19,45.97
VBAT+  (via drill 0.5)
  Top 0.254: v28.19,47.88 27.23,46.92 U2.19
  Route15 0.406: 22.86,70.99 22.86,53.21 v28.19,47.88 | 22.86,70.99 25.53,73.66 v36.7,73.66 | 22.86,70.99 20.19,73.66 v14.48,73.66
  Bottom 0.406: v36.7,73.66 X3.+1 | X3.+2 v14.48,73.66
VIN  (via drill 0.5)
  Top 0.406: v35.43,10.67 35.45,10.68 LED2.A
  pour Route15: 24.77,11.94 24.77,4.45 40.13,4.45 40.13,11.94
XTAL1
  Top 0.178: X2.3 23.16,45.42 U2.22

### Text on the board
tPlace: TMS | TCK | TX | GND | RX | TX | RST | BOOT | TDO | TDI | RX | INPUT | MOTOR CTR | ABK ECS / Rev A1 | OUTPUT | +5V | +3V3 | 230V DETECTION | FUSE | 24V